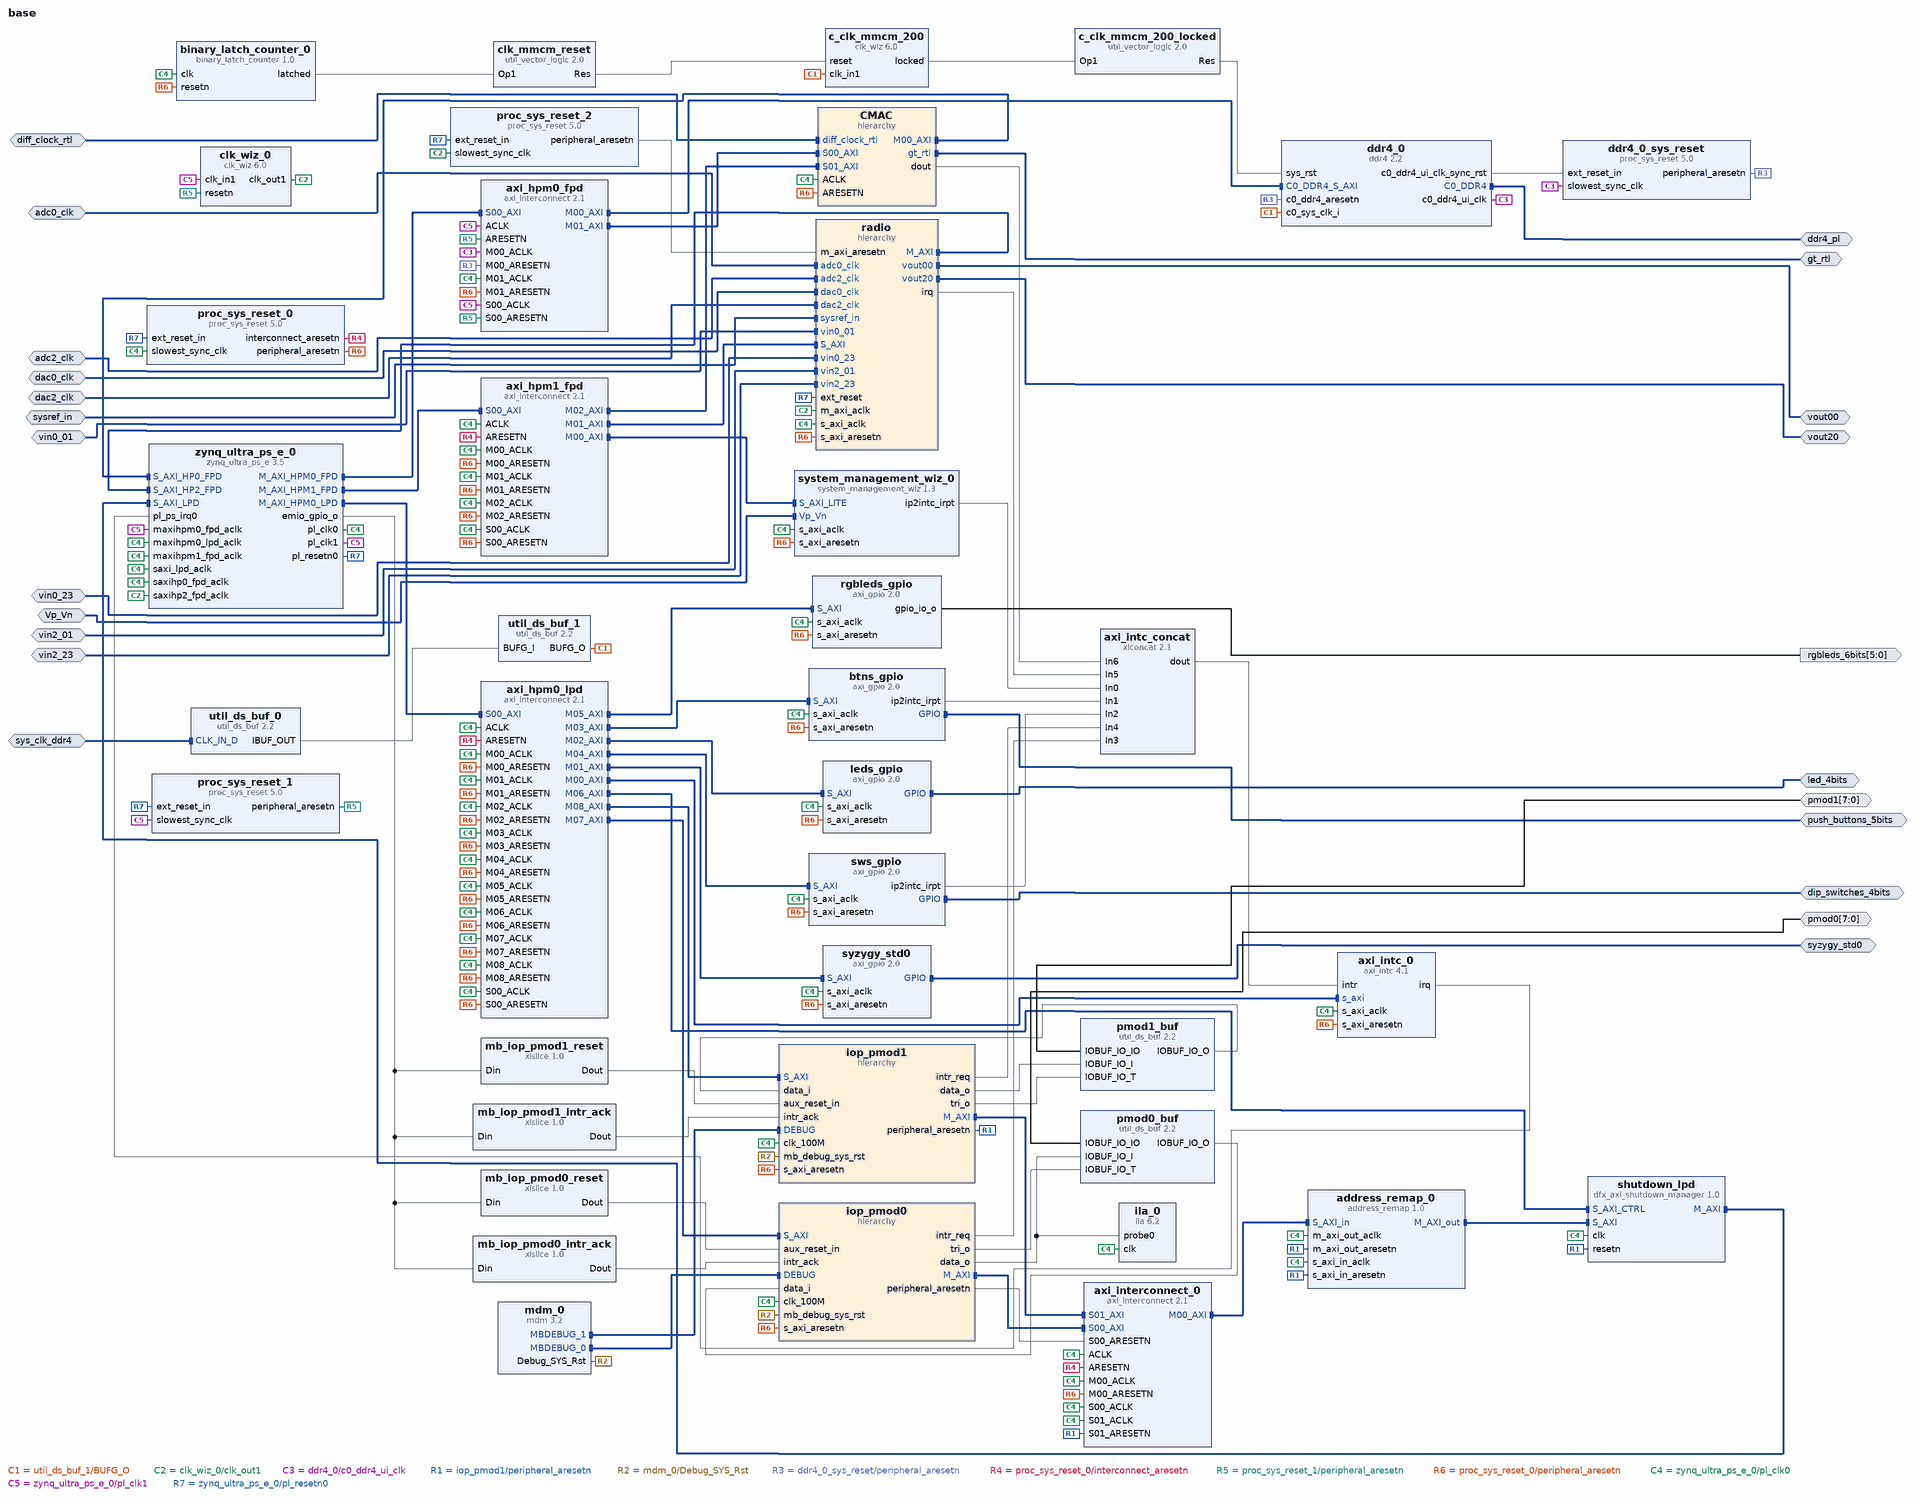
[diagram p0: block diagram of the top level]
# Vivado block design base, xczu48dr-ffvg1517-2-e, Vivado 2024.1
create_bd_design base

create_bd_intf_port -mode Slave -vlnv xilinx.com:interface:diff_analog_io_rtl:1.0 Vp_Vn
create_bd_intf_port -mode Slave -vlnv xilinx.com:interface:diff_clock_rtl:1.0 adc0_clk
set_property -dict {CONFIG.FREQ_HZ 491520000.0} [get_bd_intf_ports adc0_clk]
create_bd_intf_port -mode Slave -vlnv xilinx.com:interface:diff_clock_rtl:1.0 adc2_clk
set_property -dict {CONFIG.FREQ_HZ 491520000.0} [get_bd_intf_ports adc2_clk]
create_bd_intf_port -mode Slave -vlnv xilinx.com:interface:diff_clock_rtl:1.0 dac0_clk
set_property -dict {CONFIG.FREQ_HZ 491520000.0} [get_bd_intf_ports dac0_clk]
create_bd_intf_port -mode Slave -vlnv xilinx.com:interface:diff_clock_rtl:1.0 dac2_clk
set_property -dict {CONFIG.FREQ_HZ 491520000.0} [get_bd_intf_ports dac2_clk]
create_bd_intf_port -mode Master -vlnv xilinx.com:interface:ddr4_rtl:1.0 ddr4_pl
create_bd_intf_port -mode Slave -vlnv xilinx.com:interface:diff_clock_rtl:1.0 diff_clock_rtl
set_property -dict {CONFIG.FREQ_HZ 156250000} [get_bd_intf_ports diff_clock_rtl]
create_bd_intf_port -mode Master -vlnv xilinx.com:interface:gpio_rtl:1.0 dip_switches_4bits
create_bd_intf_port -mode Master -vlnv xilinx.com:interface:gt_rtl:1.0 gt_rtl
create_bd_intf_port -mode Master -vlnv xilinx.com:interface:gpio_rtl:1.0 led_4bits
create_bd_intf_port -mode Master -vlnv xilinx.com:interface:gpio_rtl:1.0 push_buttons_5bits
create_bd_intf_port -mode Slave -vlnv xilinx.com:interface:diff_clock_rtl:1.0 sys_clk_ddr4
set_property -dict {CONFIG.FREQ_HZ 200000000} [get_bd_intf_ports sys_clk_ddr4]
create_bd_intf_port -mode Slave -vlnv xilinx.com:display_usp_rf_data_converter:diff_pins_rtl:1.0 sysref_in
create_bd_intf_port -mode Master -vlnv xilinx.com:interface:gpio_rtl:1.0 syzygy_std0
create_bd_intf_port -mode Slave -vlnv xilinx.com:interface:diff_analog_io_rtl:1.0 vin0_01
create_bd_intf_port -mode Slave -vlnv xilinx.com:interface:diff_analog_io_rtl:1.0 vin0_23
create_bd_intf_port -mode Slave -vlnv xilinx.com:interface:diff_analog_io_rtl:1.0 vin2_01
create_bd_intf_port -mode Slave -vlnv xilinx.com:interface:diff_analog_io_rtl:1.0 vin2_23
create_bd_intf_port -mode Master -vlnv xilinx.com:interface:diff_analog_io_rtl:1.0 vout00
create_bd_intf_port -mode Master -vlnv xilinx.com:interface:diff_analog_io_rtl:1.0 vout20
create_bd_port -dir IO -from 7 -to 0 pmod0
create_bd_port -dir IO -from 7 -to 0 pmod1
create_bd_port -dir O -from 5 -to 0 rgbleds_6bits

create_bd_cell -type hier CMAC
create_bd_cell -type ip -vlnv user.org:user:address_remap:1.0 address_remap_0
set_property -dict [list \
  CONFIG.C_M_AXI_out_ADDR_WIDTH 31 \
  CONFIG.C_M_AXI_out_DATA_WIDTH 128 \
  CONFIG.C_S_AXI_in_ADDR_WIDTH 31 \
  CONFIG.C_S_AXI_in_DATA_WIDTH 128 \
] [get_bd_cells address_remap_0]
create_bd_cell -type ip -vlnv xilinx.com:ip:axi_interconnect:2.1 axi_hpm0_fpd
set_property -dict {CONFIG.NUM_MI 2 CONFIG.S00_HAS_DATA_FIFO 2} [get_bd_cells axi_hpm0_fpd]
create_bd_cell -type ip -vlnv xilinx.com:ip:axi_interconnect:2.1 axi_hpm0_lpd
set_property -dict {CONFIG.NUM_MI 9} [get_bd_cells axi_hpm0_lpd]
create_bd_cell -type ip -vlnv xilinx.com:ip:axi_interconnect:2.1 axi_hpm1_fpd
set_property -dict {CONFIG.NUM_MI 3} [get_bd_cells axi_hpm1_fpd]
create_bd_cell -type ip -vlnv xilinx.com:ip:axi_intc:4.1 axi_intc_0
set_property -dict {CONFIG.C_IRQ_CONNECTION 1} [get_bd_cells axi_intc_0]
create_bd_cell -type ip -vlnv xilinx.com:ip:xlconcat:2.1 axi_intc_concat
set_property -dict {CONFIG.NUM_PORTS 7} [get_bd_cells axi_intc_concat]
create_bd_cell -type ip -vlnv xilinx.com:ip:axi_interconnect:2.1 axi_interconnect_0
set_property -dict {CONFIG.NUM_MI 1 CONFIG.NUM_SI 2} [get_bd_cells axi_interconnect_0]
create_bd_cell -type ip -vlnv xilinx:user:binary_latch_counter:1.0 binary_latch_counter_0
create_bd_cell -type ip -vlnv xilinx.com:ip:axi_gpio:2.0 btns_gpio
set_property -dict [list \
  CONFIG.C_INTERRUPT_PRESENT 1 \
  CONFIG.GPIO_BOARD_INTERFACE push_buttons_5bits \
  CONFIG.USE_BOARD_FLOW true \
] [get_bd_cells btns_gpio]
create_bd_cell -type ip -vlnv xilinx.com:ip:clk_wiz:6.0 c_clk_mmcm_200
set_property -dict [list \
  CONFIG.CLKIN1_JITTER_PS 50.0 \
  CONFIG.CLKOUT1_JITTER 92.799 \
  CONFIG.CLKOUT1_PHASE_ERROR 82.655 \
  CONFIG.CLKOUT1_REQUESTED_OUT_FREQ 200.000 \
  CONFIG.MMCM_CLKFBOUT_MULT_F 6.000 \
  CONFIG.MMCM_CLKIN1_PERIOD 5.000 \
  CONFIG.MMCM_CLKIN2_PERIOD 10.0 \
  CONFIG.MMCM_CLKOUT0_DIVIDE_F 6.000 \
  CONFIG.PRIM_IN_FREQ 200.000 \
  CONFIG.PRIM_SOURCE No_buffer \
] [get_bd_cells c_clk_mmcm_200]
create_bd_cell -type ip -vlnv xilinx.com:ip:util_vector_logic:2.0 c_clk_mmcm_200_locked
set_property -dict {CONFIG.C_OPERATION not CONFIG.C_SIZE 1} [get_bd_cells c_clk_mmcm_200_locked]
create_bd_cell -type ip -vlnv xilinx.com:ip:util_vector_logic:2.0 clk_mmcm_reset
set_property -dict {CONFIG.C_OPERATION not CONFIG.C_SIZE 1} [get_bd_cells clk_mmcm_reset]
create_bd_cell -type ip -vlnv xilinx.com:ip:clk_wiz:6.0 clk_wiz_0
set_property -dict [list \
  CONFIG.CLKIN1_JITTER_PS 33.330000000000005 \
  CONFIG.CLKOUT1_JITTER 177.750 \
  CONFIG.CLKOUT1_PHASE_ERROR 352.538 \
  CONFIG.CLKOUT1_REQUESTED_OUT_FREQ 310.000 \
  CONFIG.MMCM_CLKFBOUT_MULT_F 120.125 \
  CONFIG.MMCM_CLKIN1_PERIOD 3.333 \
  CONFIG.MMCM_CLKIN2_PERIOD 10.0 \
  CONFIG.MMCM_CLKOUT0_DIVIDE_F 3.875 \
  CONFIG.MMCM_DIVCLK_DIVIDE 30 \
  CONFIG.RESET_PORT resetn \
  CONFIG.RESET_TYPE ACTIVE_LOW \
] [get_bd_cells clk_wiz_0]
create_bd_cell -type ip -vlnv xilinx.com:ip:ddr4:2.2 ddr4_0
set_property -dict [list \
  CONFIG.C0.BANK_GROUP_WIDTH 1 \
  CONFIG.C0.DDR4_AxiAddressWidth 33 \
  CONFIG.C0.DDR4_AxiDataWidth 512 \
  CONFIG.C0.DDR4_CasLatency 17 \
  CONFIG.C0.DDR4_CasWriteLatency 12 \
  CONFIG.C0.DDR4_DataWidth 64 \
  CONFIG.C0.DDR4_InputClockPeriod 4998 \
  CONFIG.C0.DDR4_MemoryPart MT40A1G16RC-062E \
  CONFIG.C0.DDR4_MemoryType Components \
  CONFIG.C0.DDR4_TimePeriod 833 \
  CONFIG.System_Clock No_Buffer \
] [get_bd_cells ddr4_0]
create_bd_cell -type ip -vlnv xilinx.com:ip:proc_sys_reset:5.0 ddr4_0_sys_reset
create_bd_cell -type ip -vlnv xilinx.com:ip:ila:6.2 ila_0
set_property -dict [list \
  CONFIG.C_ENABLE_ILA_AXI_MON false \
  CONFIG.C_MONITOR_TYPE Native \
  CONFIG.C_NUM_OF_PROBES 1 \
  CONFIG.C_PROBE0_WIDTH 8 \
] [get_bd_cells ila_0]
create_bd_cell -type hier iop_pmod0
create_bd_cell -type hier iop_pmod1
create_bd_cell -type ip -vlnv xilinx.com:ip:axi_gpio:2.0 leds_gpio
set_property -dict {CONFIG.GPIO_BOARD_INTERFACE led_4bits CONFIG.USE_BOARD_FLOW true} [get_bd_cells leds_gpio]
create_bd_cell -type ip -vlnv xilinx.com:ip:xlslice:1.0 mb_iop_pmod0_intr_ack
set_property -dict {CONFIG.DIN_FROM 1 CONFIG.DIN_TO 1 CONFIG.DIN_WIDTH 4 CONFIG.DOUT_WIDTH 1} [get_bd_cells mb_iop_pmod0_intr_ack]
create_bd_cell -type ip -vlnv xilinx.com:ip:xlslice:1.0 mb_iop_pmod0_reset
set_property -dict {CONFIG.DIN_WIDTH 4} [get_bd_cells mb_iop_pmod0_reset]
create_bd_cell -type ip -vlnv xilinx.com:ip:xlslice:1.0 mb_iop_pmod1_intr_ack
set_property -dict {CONFIG.DIN_FROM 3 CONFIG.DIN_TO 3 CONFIG.DIN_WIDTH 4 CONFIG.DOUT_WIDTH 1} [get_bd_cells mb_iop_pmod1_intr_ack]
create_bd_cell -type ip -vlnv xilinx.com:ip:xlslice:1.0 mb_iop_pmod1_reset
set_property -dict {CONFIG.DIN_FROM 2 CONFIG.DIN_TO 2 CONFIG.DIN_WIDTH 4 CONFIG.DOUT_WIDTH 1} [get_bd_cells mb_iop_pmod1_reset]
create_bd_cell -type ip -vlnv xilinx.com:ip:mdm:3.2 mdm_0
set_property -dict {CONFIG.C_MB_DBG_PORTS 2} [get_bd_cells mdm_0]
create_bd_cell -type ip -vlnv xilinx.com:ip:util_ds_buf:2.2 pmod0_buf
set_property -dict {CONFIG.C_BUF_TYPE IOBUF CONFIG.C_SIZE 8} [get_bd_cells pmod0_buf]
create_bd_cell -type ip -vlnv xilinx.com:ip:util_ds_buf:2.2 pmod1_buf
set_property -dict {CONFIG.C_BUF_TYPE IOBUF CONFIG.C_SIZE 8} [get_bd_cells pmod1_buf]
create_bd_cell -type ip -vlnv xilinx.com:ip:proc_sys_reset:5.0 proc_sys_reset_0
create_bd_cell -type ip -vlnv xilinx.com:ip:proc_sys_reset:5.0 proc_sys_reset_1
create_bd_cell -type ip -vlnv xilinx.com:ip:proc_sys_reset:5.0 proc_sys_reset_2
create_bd_cell -type hier radio
create_bd_cell -type ip -vlnv xilinx.com:ip:axi_gpio:2.0 rgbleds_gpio
set_property -dict [list \
  CONFIG.C_ALL_OUTPUTS 1 \
  CONFIG.C_GPIO_WIDTH 6 \
  CONFIG.GPIO_BOARD_INTERFACE Custom \
  CONFIG.USE_BOARD_FLOW true \
] [get_bd_cells rgbleds_gpio]
create_bd_cell -type ip -vlnv xilinx.com:ip:dfx_axi_shutdown_manager:1.0 shutdown_lpd
set_property -dict {CONFIG.CTRL_INTERFACE_TYPE 1 CONFIG.DP_AXI_DATA_WIDTH 128} [get_bd_cells shutdown_lpd]
create_bd_cell -type ip -vlnv xilinx.com:ip:axi_gpio:2.0 sws_gpio
set_property -dict [list \
  CONFIG.C_INTERRUPT_PRESENT 1 \
  CONFIG.GPIO_BOARD_INTERFACE dip_switches_4bits \
  CONFIG.USE_BOARD_FLOW true \
] [get_bd_cells sws_gpio]
create_bd_cell -type ip -vlnv xilinx.com:ip:system_management_wiz:1.3 system_management_wiz_0
set_property -dict {CONFIG.INTERFACE_SELECTION Enable_AXI} [get_bd_cells system_management_wiz_0]
create_bd_cell -type ip -vlnv xilinx.com:ip:axi_gpio:2.0 syzygy_std0
create_bd_cell -type ip -vlnv xilinx.com:ip:util_ds_buf:2.2 util_ds_buf_0
set_property -dict {CONFIG.C_BUF_TYPE IBUFDS} [get_bd_cells util_ds_buf_0]
create_bd_cell -type ip -vlnv xilinx.com:ip:util_ds_buf:2.2 util_ds_buf_1
set_property -dict {CONFIG.C_BUF_TYPE BUFG} [get_bd_cells util_ds_buf_1]
create_bd_cell -type ip -vlnv xilinx.com:ip:zynq_ultra_ps_e:3.5 zynq_ultra_ps_e_0
set_property -dict [list \
  CONFIG.CAN0_BOARD_INTERFACE custom \
  CONFIG.CAN1_BOARD_INTERFACE custom \
  CONFIG.CSU_BOARD_INTERFACE custom \
  CONFIG.DP_BOARD_INTERFACE custom \
  CONFIG.GEM0_BOARD_INTERFACE custom \
  CONFIG.GEM1_BOARD_INTERFACE custom \
  CONFIG.GEM2_BOARD_INTERFACE custom \
  CONFIG.GEM3_BOARD_INTERFACE custom \
  CONFIG.GPIO_BOARD_INTERFACE custom \
  CONFIG.IIC0_BOARD_INTERFACE custom \
  CONFIG.IIC1_BOARD_INTERFACE custom \
  CONFIG.NAND_BOARD_INTERFACE custom \
  CONFIG.PCIE_BOARD_INTERFACE custom \
  CONFIG.PJTAG_BOARD_INTERFACE custom \
  CONFIG.PMU_BOARD_INTERFACE custom \
  CONFIG.PSU_BANK_0_IO_STANDARD LVCMOS33 \
  CONFIG.PSU_BANK_1_IO_STANDARD LVCMOS18 \
  CONFIG.PSU_BANK_2_IO_STANDARD LVCMOS18 \
  CONFIG.PSU_BANK_3_IO_STANDARD LVCMOS18 \
  CONFIG.PSU_USB3__DUAL_CLOCK_ENABLE 1 \
  CONFIG.PSU__CAN1__PERIPHERAL__ENABLE 0 \
  CONFIG.PSU__CRF_APB__ACPU_CTRL__FREQMHZ 1200 \
  CONFIG.PSU__CRF_APB__ACPU_CTRL__SRCSEL APLL \
  CONFIG.PSU__CRF_APB__APLL_CTRL__SRCSEL PSS_REF_CLK \
  CONFIG.PSU__CRF_APB__DBG_FPD_CTRL__FREQMHZ 250 \
  CONFIG.PSU__CRF_APB__DBG_FPD_CTRL__SRCSEL IOPLL \
  CONFIG.PSU__CRF_APB__DBG_TRACE_CTRL__FREQMHZ 250 \
  CONFIG.PSU__CRF_APB__DBG_TRACE_CTRL__SRCSEL IOPLL \
  CONFIG.PSU__CRF_APB__DBG_TSTMP_CTRL__FREQMHZ 250 \
  CONFIG.PSU__CRF_APB__DBG_TSTMP_CTRL__SRCSEL IOPLL \
  CONFIG.PSU__CRF_APB__DDR_CTRL__FREQMHZ 1200 \
  CONFIG.PSU__CRF_APB__DDR_CTRL__SRCSEL DPLL \
  CONFIG.PSU__CRF_APB__DPDMA_REF_CTRL__FREQMHZ 600 \
  CONFIG.PSU__CRF_APB__DPDMA_REF_CTRL__SRCSEL DPLL \
  CONFIG.PSU__CRF_APB__DPLL_CTRL__SRCSEL PSS_REF_CLK \
  CONFIG.PSU__CRF_APB__DP_AUDIO_REF_CTRL__SRCSEL RPLL \
  CONFIG.PSU__CRF_APB__DP_STC_REF_CTRL__SRCSEL RPLL \
  CONFIG.PSU__CRF_APB__DP_VIDEO_REF_CTRL__SRCSEL DPLL \
  CONFIG.PSU__CRF_APB__GDMA_REF_CTRL__FREQMHZ 600 \
  CONFIG.PSU__CRF_APB__GDMA_REF_CTRL__SRCSEL DPLL \
  CONFIG.PSU__CRF_APB__GPU_REF_CTRL__FREQMHZ 600 \
  CONFIG.PSU__CRF_APB__GPU_REF_CTRL__SRCSEL DPLL \
  CONFIG.PSU__CRF_APB__TOPSW_LSBUS_CTRL__FREQMHZ 100 \
  CONFIG.PSU__CRF_APB__TOPSW_LSBUS_CTRL__SRCSEL IOPLL \
  CONFIG.PSU__CRF_APB__TOPSW_MAIN_CTRL__FREQMHZ 533.33 \
  CONFIG.PSU__CRF_APB__TOPSW_MAIN_CTRL__SRCSEL DPLL \
  CONFIG.PSU__CRF_APB__VPLL_CTRL__SRCSEL PSS_REF_CLK \
  CONFIG.PSU__CRL_APB__ADMA_REF_CTRL__FREQMHZ 533.333 \
  CONFIG.PSU__CRL_APB__ADMA_REF_CTRL__SRCSEL RPLL \
  CONFIG.PSU__CRL_APB__CAN1_REF_CTRL__FREQMHZ 100 \
  CONFIG.PSU__CRL_APB__CAN1_REF_CTRL__SRCSEL IOPLL \
  CONFIG.PSU__CRL_APB__CPU_R5_CTRL__FREQMHZ 500 \
  CONFIG.PSU__CRL_APB__CPU_R5_CTRL__SRCSEL IOPLL \
  CONFIG.PSU__CRL_APB__DBG_LPD_CTRL__FREQMHZ 250 \
  CONFIG.PSU__CRL_APB__DBG_LPD_CTRL__SRCSEL IOPLL \
  CONFIG.PSU__CRL_APB__GEM3_REF_CTRL__FREQMHZ 125 \
  CONFIG.PSU__CRL_APB__GEM3_REF_CTRL__SRCSEL IOPLL \
  CONFIG.PSU__CRL_APB__I2C0_REF_CTRL__FREQMHZ 100 \
  CONFIG.PSU__CRL_APB__I2C0_REF_CTRL__SRCSEL IOPLL \
  CONFIG.PSU__CRL_APB__I2C1_REF_CTRL__FREQMHZ 100 \
  CONFIG.PSU__CRL_APB__I2C1_REF_CTRL__SRCSEL IOPLL \
  CONFIG.PSU__CRL_APB__IOPLL_CTRL__SRCSEL PSS_REF_CLK \
  CONFIG.PSU__CRL_APB__IOU_SWITCH_CTRL__FREQMHZ 267 \
  CONFIG.PSU__CRL_APB__IOU_SWITCH_CTRL__SRCSEL RPLL \
  CONFIG.PSU__CRL_APB__LPD_LSBUS_CTRL__FREQMHZ 100 \
  CONFIG.PSU__CRL_APB__LPD_LSBUS_CTRL__SRCSEL IOPLL \
  CONFIG.PSU__CRL_APB__LPD_SWITCH_CTRL__FREQMHZ 533.333 \
  CONFIG.PSU__CRL_APB__LPD_SWITCH_CTRL__SRCSEL RPLL \
  CONFIG.PSU__CRL_APB__PCAP_CTRL__FREQMHZ 200 \
  CONFIG.PSU__CRL_APB__PCAP_CTRL__SRCSEL IOPLL \
  CONFIG.PSU__CRL_APB__PL0_REF_CTRL__FREQMHZ 100 \
  CONFIG.PSU__CRL_APB__PL0_REF_CTRL__SRCSEL IOPLL \
  CONFIG.PSU__CRL_APB__PL1_REF_CTRL__FREQMHZ 300 \
  CONFIG.PSU__CRL_APB__PL1_REF_CTRL__SRCSEL IOPLL \
  CONFIG.PSU__CRL_APB__QSPI_REF_CTRL__FREQMHZ 125 \
  CONFIG.PSU__CRL_APB__QSPI_REF_CTRL__SRCSEL IOPLL \
  CONFIG.PSU__CRL_APB__RPLL_CTRL__SRCSEL PSS_REF_CLK \
  CONFIG.PSU__CRL_APB__SDIO0_REF_CTRL__SRCSEL IOPLL \
  CONFIG.PSU__CRL_APB__SDIO1_REF_CTRL__FREQMHZ 200 \
  CONFIG.PSU__CRL_APB__SDIO1_REF_CTRL__SRCSEL IOPLL \
  CONFIG.PSU__CRL_APB__SPI0_REF_CTRL__FREQMHZ 20 \
  CONFIG.PSU__CRL_APB__SPI0_REF_CTRL__SRCSEL IOPLL \
  CONFIG.PSU__CRL_APB__SPI1_REF_CTRL__FREQMHZ 1 \
  CONFIG.PSU__CRL_APB__SPI1_REF_CTRL__SRCSEL IOPLL \
  CONFIG.PSU__CRL_APB__TIMESTAMP_REF_CTRL__FREQMHZ 100 \
  CONFIG.PSU__CRL_APB__TIMESTAMP_REF_CTRL__SRCSEL PSS_REF_CLK \
  CONFIG.PSU__CRL_APB__UART0_REF_CTRL__FREQMHZ 100 \
  CONFIG.PSU__CRL_APB__UART0_REF_CTRL__SRCSEL IOPLL \
  CONFIG.PSU__CRL_APB__UART1_REF_CTRL__FREQMHZ 100 \
  CONFIG.PSU__CRL_APB__UART1_REF_CTRL__SRCSEL IOPLL \
  CONFIG.PSU__CRL_APB__USB0_BUS_REF_CTRL__FREQMHZ 250 \
  CONFIG.PSU__CRL_APB__USB0_BUS_REF_CTRL__SRCSEL IOPLL \
  CONFIG.PSU__CRL_APB__USB3_DUAL_REF_CTRL__FREQMHZ 20 \
  CONFIG.PSU__CRL_APB__USB3_DUAL_REF_CTRL__SRCSEL IOPLL \
  CONFIG.PSU__CRL_APB__USB3__ENABLE 1 \
  CONFIG.PSU__CSUPMU__PERIPHERAL__VALID 0 \
  CONFIG.PSU__DDRC__BUS_WIDTH {64 Bit} \
  CONFIG.PSU__DDRC__COMPONENTS Components \
  CONFIG.PSU__DDRC__DEVICE_CAPACITY {16384 MBits} \
  CONFIG.PSU__DDRC__DRAM_WIDTH {16 Bits} \
  CONFIG.PSU__DDRC__ECC Disabled \
  CONFIG.PSU__DDRC__MEMORY_TYPE {DDR 4} \
  CONFIG.PSU__DDRC__SPEED_BIN DDR4_2400R \
  CONFIG.PSU__DDR_HIGH_ADDRESS_GUI_ENABLE 1 \
  CONFIG.PSU__DDR__INTERFACE__FREQMHZ 600.000 \
  CONFIG.PSU__DEVICE_TYPE RFSOC \
  CONFIG.PSU__DISPLAYPORT__LANE0__ENABLE 1 \
  CONFIG.PSU__DISPLAYPORT__LANE0__IO {GT Lane1} \
  CONFIG.PSU__DISPLAYPORT__LANE1__ENABLE 1 \
  CONFIG.PSU__DISPLAYPORT__LANE1__IO {GT Lane0} \
  CONFIG.PSU__DISPLAYPORT__PERIPHERAL__ENABLE 1 \
  CONFIG.PSU__DLL__ISUSED 1 \
  CONFIG.PSU__DPAUX__PERIPHERAL__ENABLE 1 \
  CONFIG.PSU__DPAUX__PERIPHERAL__IO {MIO 27 .. 30} \
  CONFIG.PSU__DP__LANE_SEL {Dual Lower} \
  CONFIG.PSU__DP__REF_CLK_FREQ 27 \
  CONFIG.PSU__DP__REF_CLK_SEL {Ref Clk0} \
  CONFIG.PSU__ENET1__GRP_MDIO__ENABLE 1 \
  CONFIG.PSU__ENET1__GRP_MDIO__IO {MIO 50 .. 51} \
  CONFIG.PSU__ENET1__PERIPHERAL__ENABLE 1 \
  CONFIG.PSU__ENET1__PERIPHERAL__IO {MIO 38 .. 49} \
  CONFIG.PSU__ENET3__PERIPHERAL__ENABLE 0 \
  CONFIG.PSU__FPD_SLCR__WDT1__FREQMHZ 100 \
  CONFIG.PSU__FPGA_PL0_ENABLE 1 \
  CONFIG.PSU__FPGA_PL1_ENABLE 1 \
  CONFIG.PSU__GEM__TSU__ENABLE 0 \
  CONFIG.PSU__GPIO0_MIO__IO {MIO 0 .. 25} \
  CONFIG.PSU__GPIO0_MIO__PERIPHERAL__ENABLE 1 \
  CONFIG.PSU__GPIO1_MIO__IO {MIO 26 .. 51} \
  CONFIG.PSU__GPIO1_MIO__PERIPHERAL__ENABLE 1 \
  CONFIG.PSU__GPIO2_MIO__IO {MIO 52 .. 77} \
  CONFIG.PSU__GPIO2_MIO__PERIPHERAL__ENABLE 1 \
  CONFIG.PSU__GPIO_EMIO_WIDTH 95 \
  CONFIG.PSU__GPIO_EMIO__PERIPHERAL__ENABLE 1 \
  CONFIG.PSU__GPIO_EMIO__PERIPHERAL__IO 95 \
  CONFIG.PSU__GPU_PP0__POWER__ON 0 \
  CONFIG.PSU__GPU_PP1__POWER__ON 0 \
  CONFIG.PSU__GT__LINK_SPEED HBR \
  CONFIG.PSU__GT__PRE_EMPH_LVL_4 0 \
  CONFIG.PSU__GT__VLT_SWNG_LVL_4 0 \
  CONFIG.PSU__I2C0__PERIPHERAL__ENABLE 1 \
  CONFIG.PSU__I2C0__PERIPHERAL__IO {MIO 18 .. 19} \
  CONFIG.PSU__I2C1__PERIPHERAL__ENABLE 1 \
  CONFIG.PSU__I2C1__PERIPHERAL__IO {MIO 36 .. 37} \
  CONFIG.PSU__IOU_SLCR__IOU_TTC_APB_CLK__TTC0_SEL APB \
  CONFIG.PSU__IOU_SLCR__IOU_TTC_APB_CLK__TTC1_SEL APB \
  CONFIG.PSU__IOU_SLCR__IOU_TTC_APB_CLK__TTC2_SEL APB \
  CONFIG.PSU__IOU_SLCR__IOU_TTC_APB_CLK__TTC3_SEL APB \
  CONFIG.PSU__IOU_SLCR__TTC0__FREQMHZ 100 \
  CONFIG.PSU__IOU_SLCR__TTC1__FREQMHZ 100 \
  CONFIG.PSU__IOU_SLCR__TTC2__FREQMHZ 100 \
  CONFIG.PSU__IOU_SLCR__TTC3__FREQMHZ 100 \
  CONFIG.PSU__IOU_SLCR__WDT0__FREQMHZ 100 \
  CONFIG.PSU__LPD_SLCR__CSUPMU__FREQMHZ 100 \
  CONFIG.PSU__MAXIGP0__DATA_WIDTH 128 \
  CONFIG.PSU__OVERRIDE_HPX_QOS 0 \
  CONFIG.PSU__OVERRIDE__BASIC_CLOCK 0 \
  CONFIG.PSU__PMU__PERIPHERAL__ENABLE 0 \
  CONFIG.PSU__PRESET_APPLIED 1 \
  CONFIG.PSU__PSS_REF_CLK__FREQMHZ 33.33333 \
  CONFIG.PSU__QSPI__PERIPHERAL__ENABLE 0 \
  CONFIG.PSU__SATA__PERIPHERAL__ENABLE 0 \
  CONFIG.PSU__SD0__CLK_50_SDR_ITAP_DLY 0x15 \
  CONFIG.PSU__SD0__CLK_50_SDR_OTAP_DLY 0x5 \
  CONFIG.PSU__SD0__DATA_TRANSFER_MODE 4Bit \
  CONFIG.PSU__SD0__GRP_CD__ENABLE 1 \
  CONFIG.PSU__SD0__GRP_CD__IO {MIO 24} \
  CONFIG.PSU__SD0__GRP_WP__ENABLE 1 \
  CONFIG.PSU__SD0__GRP_WP__IO {MIO 25} \
  CONFIG.PSU__SD0__PERIPHERAL__ENABLE 1 \
  CONFIG.PSU__SD0__PERIPHERAL__IO {MIO 13 .. 16 21 22} \
  CONFIG.PSU__SD0__SLOT_TYPE {SD 2.0} \
  CONFIG.PSU__SD1__CLK_100_SDR_OTAP_DLY 0x3 \
  CONFIG.PSU__SD1__CLK_200_SDR_OTAP_DLY 0x3 \
  CONFIG.PSU__SD1__CLK_50_DDR_ITAP_DLY 0x3D \
  CONFIG.PSU__SD1__CLK_50_DDR_OTAP_DLY 0x4 \
  CONFIG.PSU__SD1__CLK_50_SDR_ITAP_DLY 0x15 \
  CONFIG.PSU__SD1__CLK_50_SDR_OTAP_DLY 0x5 \
  CONFIG.PSU__SD1__PERIPHERAL__ENABLE 0 \
  CONFIG.PSU__SPI0__GRP_SS0__IO {MIO 3} \
  CONFIG.PSU__SPI0__GRP_SS1__ENABLE 1 \
  CONFIG.PSU__SPI0__GRP_SS1__IO {MIO 2} \
  CONFIG.PSU__SPI0__GRP_SS2__ENABLE 1 \
  CONFIG.PSU__SPI0__GRP_SS2__IO {MIO 1} \
  CONFIG.PSU__SPI0__PERIPHERAL__ENABLE 1 \
  CONFIG.PSU__SPI0__PERIPHERAL__IO {MIO 0 .. 5} \
  CONFIG.PSU__SPI1__GRP_SS0__IO {MIO 9} \
  CONFIG.PSU__SPI1__PERIPHERAL__ENABLE 1 \
  CONFIG.PSU__SPI1__PERIPHERAL__IO {MIO 6 .. 11} \
  CONFIG.PSU__SWDT0__PERIPHERAL__ENABLE 0 \
  CONFIG.PSU__SWDT1__PERIPHERAL__ENABLE 0 \
  CONFIG.PSU__TSU__BUFG_PORT_PAIR 0 \
  CONFIG.PSU__TTC0__PERIPHERAL__ENABLE 0 \
  CONFIG.PSU__TTC1__PERIPHERAL__ENABLE 0 \
  CONFIG.PSU__TTC2__PERIPHERAL__ENABLE 0 \
  CONFIG.PSU__TTC3__PERIPHERAL__ENABLE 0 \
  CONFIG.PSU__UART0__PERIPHERAL__ENABLE 0 \
  CONFIG.PSU__UART1__BAUD_RATE 115200 \
  CONFIG.PSU__UART1__MODEM__ENABLE 0 \
  CONFIG.PSU__UART1__PERIPHERAL__ENABLE 1 \
  CONFIG.PSU__UART1__PERIPHERAL__IO {MIO 32 .. 33} \
  CONFIG.PSU__USB0_COHERENCY 0 \
  CONFIG.PSU__USB0__PERIPHERAL__ENABLE 1 \
  CONFIG.PSU__USB0__PERIPHERAL__IO {MIO 52 .. 63} \
  CONFIG.PSU__USB0__REF_CLK_FREQ 100 \
  CONFIG.PSU__USB0__REF_CLK_SEL {Ref Clk1} \
  CONFIG.PSU__USB1__PERIPHERAL__ENABLE 1 \
  CONFIG.PSU__USB1__PERIPHERAL__IO {MIO 64 .. 75} \
  CONFIG.PSU__USB1__REF_CLK_FREQ 100 \
  CONFIG.PSU__USB1__REF_CLK_SEL {Ref Clk1} \
  CONFIG.PSU__USB2_0__EMIO__ENABLE 0 \
  CONFIG.PSU__USB3_0__EMIO__ENABLE 0 \
  CONFIG.PSU__USB3_0__PERIPHERAL__ENABLE 1 \
  CONFIG.PSU__USB3_0__PERIPHERAL__IO {GT Lane2} \
  CONFIG.PSU__USB3_1__PERIPHERAL__ENABLE 1 \
  CONFIG.PSU__USB3_1__PERIPHERAL__IO {GT Lane3} \
  CONFIG.PSU__USB__RESET__MODE {Boot Pin} \
  CONFIG.PSU__USB__RESET__POLARITY {Active Low} \
  CONFIG.PSU__USE__IRQ0 1 \
  CONFIG.PSU__USE__M_AXI_GP0 1 \
  CONFIG.PSU__USE__M_AXI_GP1 1 \
  CONFIG.PSU__USE__M_AXI_GP2 1 \
  CONFIG.PSU__USE__S_AXI_GP2 1 \
  CONFIG.PSU__USE__S_AXI_GP4 1 \
  CONFIG.PSU__USE__S_AXI_GP6 1 \
  CONFIG.QSPI_BOARD_INTERFACE custom \
  CONFIG.SATA_BOARD_INTERFACE custom \
  CONFIG.SD0_BOARD_INTERFACE custom \
  CONFIG.SD1_BOARD_INTERFACE custom \
  CONFIG.SPI0_BOARD_INTERFACE custom \
  CONFIG.SPI1_BOARD_INTERFACE custom \
  CONFIG.SUBPRESET1 Custom \
  CONFIG.SUBPRESET2 Custom \
  CONFIG.SWDT0_BOARD_INTERFACE custom \
  CONFIG.SWDT1_BOARD_INTERFACE custom \
  CONFIG.TRACE_BOARD_INTERFACE custom \
  CONFIG.TTC0_BOARD_INTERFACE custom \
  CONFIG.TTC1_BOARD_INTERFACE custom \
  CONFIG.TTC2_BOARD_INTERFACE custom \
  CONFIG.TTC3_BOARD_INTERFACE custom \
  CONFIG.UART0_BOARD_INTERFACE custom \
  CONFIG.UART1_BOARD_INTERFACE custom \
  CONFIG.USB0_BOARD_INTERFACE custom \
  CONFIG.USB1_BOARD_INTERFACE custom \
] [get_bd_cells zynq_ultra_ps_e_0]
# 722 more settings of zynq_ultra_ps_e_0 are not shown: defaults, MIO pin electricals, DDR timing, and values the tool derives

# ---- hierarchy /CMAC ----
current_bd_instance /CMAC
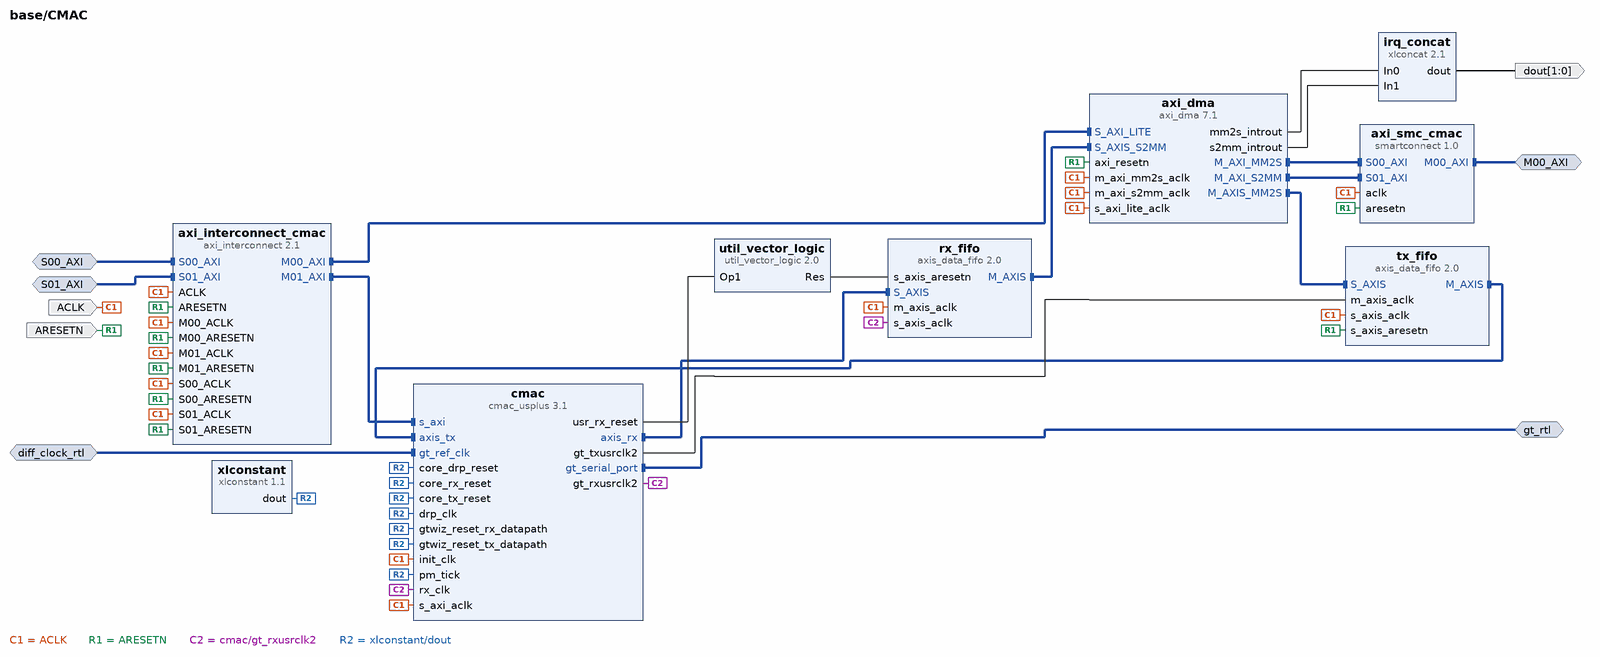
[diagram p1: block diagram inside /CMAC]
create_bd_intf_pin -mode Master -vlnv xilinx.com:interface:aximm_rtl:1.0 M00_AXI
create_bd_intf_pin -mode Slave -vlnv xilinx.com:interface:aximm_rtl:1.0 S00_AXI
create_bd_intf_pin -mode Slave -vlnv xilinx.com:interface:aximm_rtl:1.0 S01_AXI
create_bd_intf_pin -mode Slave -vlnv xilinx.com:interface:diff_clock_rtl:1.0 diff_clock_rtl
create_bd_intf_pin -mode Master -vlnv xilinx.com:interface:gt_rtl:1.0 gt_rtl
create_bd_pin -dir I -type clk ACLK
create_bd_pin -dir I -type rst ARESETN
create_bd_pin -dir O -from 1 -to 0 dout

create_bd_cell -type ip -vlnv xilinx.com:ip:axi_dma:7.1 axi_dma
set_property -dict [list \
  CONFIG.c_include_sg 0 \
  CONFIG.c_m_axi_mm2s_data_width 512 \
  CONFIG.c_m_axi_s2mm_data_width 512 \
  CONFIG.c_m_axis_mm2s_tdata_width 512 \
  CONFIG.c_mm2s_burst_size 16 \
  CONFIG.c_s_axis_s2mm_tdata_width 512 \
  CONFIG.c_sg_length_width 26 \
] [get_bd_cells axi_dma]
create_bd_cell -type ip -vlnv xilinx.com:ip:axi_interconnect:2.1 axi_interconnect_cmac
set_property -dict {CONFIG.NUM_MI 2 CONFIG.NUM_SI 2} [get_bd_cells axi_interconnect_cmac]
create_bd_cell -type ip -vlnv xilinx.com:ip:smartconnect:1.0 axi_smc_cmac
create_bd_cell -type ip -vlnv xilinx.com:ip:cmac_usplus:3.1 cmac
set_property -dict [list \
  CONFIG.CMAC_CAUI4_MODE 1 \
  CONFIG.CMAC_CORE_SELECT CMACE4_X0Y0 \
  CONFIG.ENABLE_AXI_INTERFACE 1 \
  CONFIG.GT_GROUP_SELECT {X0Y4~X0Y7} \
  CONFIG.GT_REF_CLK_FREQ 156.25 \
  CONFIG.INCLUDE_RS_FEC 0 \
  CONFIG.INCLUDE_STATISTICS_COUNTERS 1 \
  CONFIG.INS_LOSS_NYQ 1 \
  CONFIG.NUM_LANES 4x25 \
  CONFIG.RX_EQ_MODE DFE \
  CONFIG.RX_FLOW_CONTROL 0 \
  CONFIG.TX_FLOW_CONTROL 0 \
  CONFIG.USER_INTERFACE AXIS \
] [get_bd_cells cmac]
create_bd_cell -type ip -vlnv xilinx.com:ip:xlconcat:2.1 irq_concat
create_bd_cell -type ip -vlnv xilinx.com:ip:axis_data_fifo:2.0 rx_fifo
set_property -dict {CONFIG.FIFO_MODE 2 CONFIG.HAS_TKEEP 1 CONFIG.IS_ACLK_ASYNC 1 CONFIG.TDATA_NUM_BYTES 64} [get_bd_cells rx_fifo]
create_bd_cell -type ip -vlnv xilinx.com:ip:axis_data_fifo:2.0 tx_fifo
set_property -dict {CONFIG.FIFO_MODE 2 CONFIG.HAS_TKEEP 1 CONFIG.IS_ACLK_ASYNC 1 CONFIG.TDATA_NUM_BYTES 64} [get_bd_cells tx_fifo]
create_bd_cell -type ip -vlnv xilinx.com:ip:util_vector_logic:2.0 util_vector_logic
set_property -dict {CONFIG.C_OPERATION not CONFIG.C_SIZE 1} [get_bd_cells util_vector_logic]
create_bd_cell -type ip -vlnv xilinx.com:ip:xlconstant:1.1 xlconstant
set_property -dict {CONFIG.CONST_VAL 0} [get_bd_cells xlconstant]

# ---- hierarchy /iop_pmod0 ----
current_bd_instance /iop_pmod0
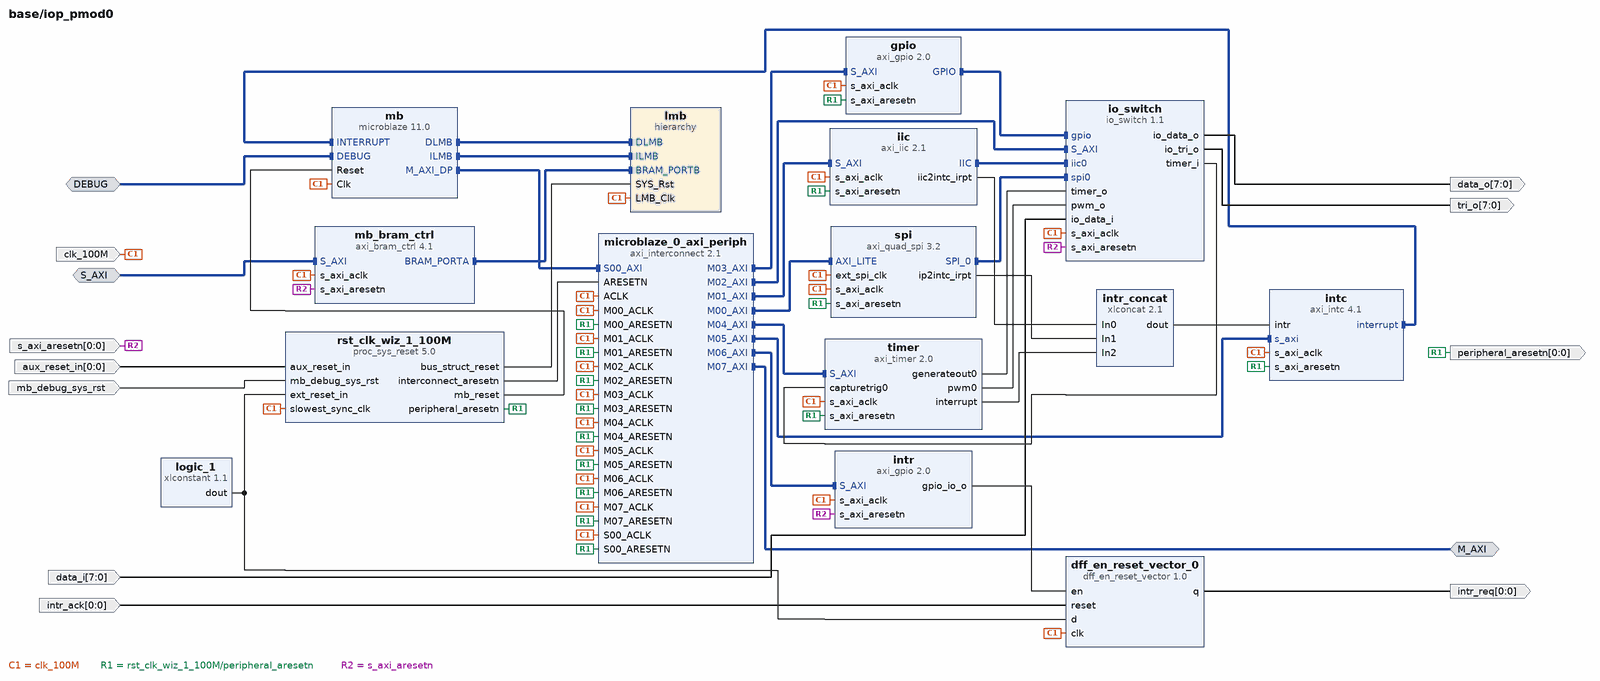
[diagram p2: block diagram inside /iop_pmod0]
create_bd_intf_pin -mode Slave -vlnv xilinx.com:interface:mbdebug_rtl:3.0 DEBUG
create_bd_intf_pin -mode Master -vlnv xilinx.com:interface:aximm_rtl:1.0 M_AXI
create_bd_intf_pin -mode Slave -vlnv xilinx.com:interface:aximm_rtl:1.0 S_AXI
create_bd_pin -dir I -from 0 -to 0 -type rst aux_reset_in
create_bd_pin -dir I -type clk clk_100M
create_bd_pin -dir I -from 7 -to 0 data_i
create_bd_pin -dir O -from 7 -to 0 data_o
create_bd_pin -dir I -from 0 -to 0 intr_ack
create_bd_pin -dir O -from 0 -to 0 intr_req
create_bd_pin -dir I -type rst mb_debug_sys_rst
create_bd_pin -dir O -from 0 -to 0 -type rst peripheral_aresetn
create_bd_pin -dir I -from 0 -to 0 -type rst s_axi_aresetn
create_bd_pin -dir O -from 7 -to 0 tri_o

create_bd_cell -type ip -vlnv xilinx.com:user:dff_en_reset_vector:1.0 dff_en_reset_vector_0
set_property -dict {CONFIG.SIZE 1} [get_bd_cells dff_en_reset_vector_0]
create_bd_cell -type ip -vlnv xilinx.com:ip:axi_gpio:2.0 gpio
set_property -dict {CONFIG.C_GPIO_WIDTH 8 CONFIG.C_IS_DUAL 0} [get_bd_cells gpio]
create_bd_cell -type ip -vlnv xilinx.com:ip:axi_iic:2.1 iic
create_bd_cell -type ip -vlnv xilinx.com:ip:axi_intc:4.1 intc
create_bd_cell -type ip -vlnv xilinx.com:ip:axi_gpio:2.0 intr
set_property -dict {CONFIG.C_ALL_OUTPUTS 1 CONFIG.C_GPIO_WIDTH 1} [get_bd_cells intr]
create_bd_cell -type ip -vlnv xilinx.com:ip:xlconcat:2.1 intr_concat
set_property -dict {CONFIG.NUM_PORTS 3} [get_bd_cells intr_concat]
create_bd_cell -type ip -vlnv xilinx.com:user:io_switch:1.1 io_switch
set_property -dict [list \
  CONFIG.C_INTERFACE_TYPE 1 \
  CONFIG.C_IO_SWITCH_WIDTH 8 \
  CONFIG.C_NUM_PWMS 1 \
  CONFIG.C_NUM_TIMERS 1 \
  CONFIG.I2C0_Enable true \
  CONFIG.PWM_Enable true \
  CONFIG.SPI0_Enable true \
  CONFIG.Timer_Enable true \
] [get_bd_cells io_switch]
create_bd_cell -type hier lmb
create_bd_cell -type ip -vlnv xilinx.com:ip:xlconstant:1.1 logic_1
create_bd_cell -type ip -vlnv xilinx.com:ip:microblaze:11.0 mb
set_property -dict [list \
  CONFIG.C_ADDR_TAG_BITS 17 \
  CONFIG.C_DCACHE_ADDR_TAG 17 \
  CONFIG.C_DEBUG_ENABLED 1 \
  CONFIG.C_D_AXI 1 \
  CONFIG.C_D_LMB 1 \
  CONFIG.C_I_LMB 1 \
] [get_bd_cells mb]
create_bd_cell -type ip -vlnv xilinx.com:ip:axi_bram_ctrl:4.1 mb_bram_ctrl
set_property -dict {CONFIG.SINGLE_PORT_BRAM 1} [get_bd_cells mb_bram_ctrl]
create_bd_cell -type ip -vlnv xilinx.com:ip:axi_interconnect:2.1 microblaze_0_axi_periph
set_property -dict [list \
  CONFIG.M00_HAS_REGSLICE 1 \
  CONFIG.M01_HAS_REGSLICE 1 \
  CONFIG.M02_HAS_REGSLICE 1 \
  CONFIG.M03_HAS_REGSLICE 1 \
  CONFIG.M04_HAS_REGSLICE 1 \
  CONFIG.M05_HAS_REGSLICE 1 \
  CONFIG.M06_HAS_REGSLICE 1 \
  CONFIG.M07_HAS_REGSLICE 1 \
  CONFIG.NUM_MI 8 \
  CONFIG.S00_HAS_REGSLICE 1 \
] [get_bd_cells microblaze_0_axi_periph]
create_bd_cell -type ip -vlnv xilinx.com:ip:proc_sys_reset:5.0 rst_clk_wiz_1_100M
set_property -dict {CONFIG.C_AUX_RESET_HIGH 1} [get_bd_cells rst_clk_wiz_1_100M]
create_bd_cell -type ip -vlnv xilinx.com:ip:axi_quad_spi:3.2 spi
set_property -dict {CONFIG.C_USE_STARTUP 0} [get_bd_cells spi]
create_bd_cell -type ip -vlnv xilinx.com:ip:axi_timer:2.0 timer

# ---- hierarchy /iop_pmod0/lmb ----
current_bd_instance /iop_pmod0/lmb
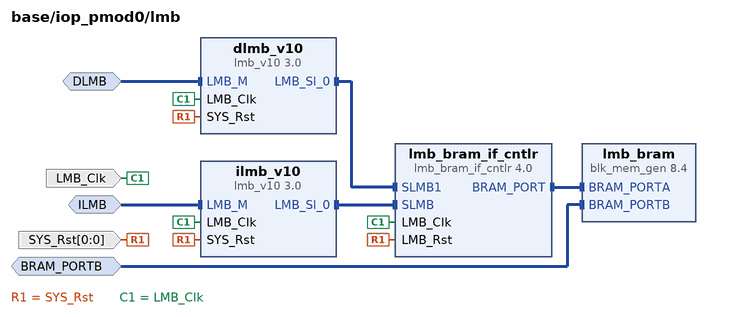
[diagram p3: block diagram inside /iop_pmod0/lmb]
create_bd_intf_pin -mode Slave -vlnv xilinx.com:interface:bram_rtl:1.0 BRAM_PORTB
create_bd_intf_pin -mode MirroredMaster -vlnv xilinx.com:interface:lmb_rtl:1.0 DLMB
create_bd_intf_pin -mode MirroredMaster -vlnv xilinx.com:interface:lmb_rtl:1.0 ILMB
create_bd_pin -dir I -type clk LMB_Clk
create_bd_pin -dir I -from 0 -to 0 -type rst SYS_Rst

create_bd_cell -type ip -vlnv xilinx.com:ip:lmb_v10:3.0 dlmb_v10
create_bd_cell -type ip -vlnv xilinx.com:ip:lmb_v10:3.0 ilmb_v10
create_bd_cell -type ip -vlnv xilinx.com:ip:blk_mem_gen:8.4 lmb_bram
set_property -dict [list \
  CONFIG.Enable_B Use_ENB_Pin \
  CONFIG.Memory_Type True_Dual_Port_RAM \
  CONFIG.Port_B_Clock 100 \
  CONFIG.Port_B_Enable_Rate 100 \
  CONFIG.Port_B_Write_Rate 50 \
  CONFIG.Use_RSTB_Pin true \
  CONFIG.use_bram_block BRAM_Controller \
] [get_bd_cells lmb_bram]
create_bd_cell -type ip -vlnv xilinx.com:ip:lmb_bram_if_cntlr:4.0 lmb_bram_if_cntlr
set_property -dict {CONFIG.C_ECC 0 CONFIG.C_NUM_LMB 2} [get_bd_cells lmb_bram_if_cntlr]

# ---- hierarchy /iop_pmod1 ----
current_bd_instance /iop_pmod1
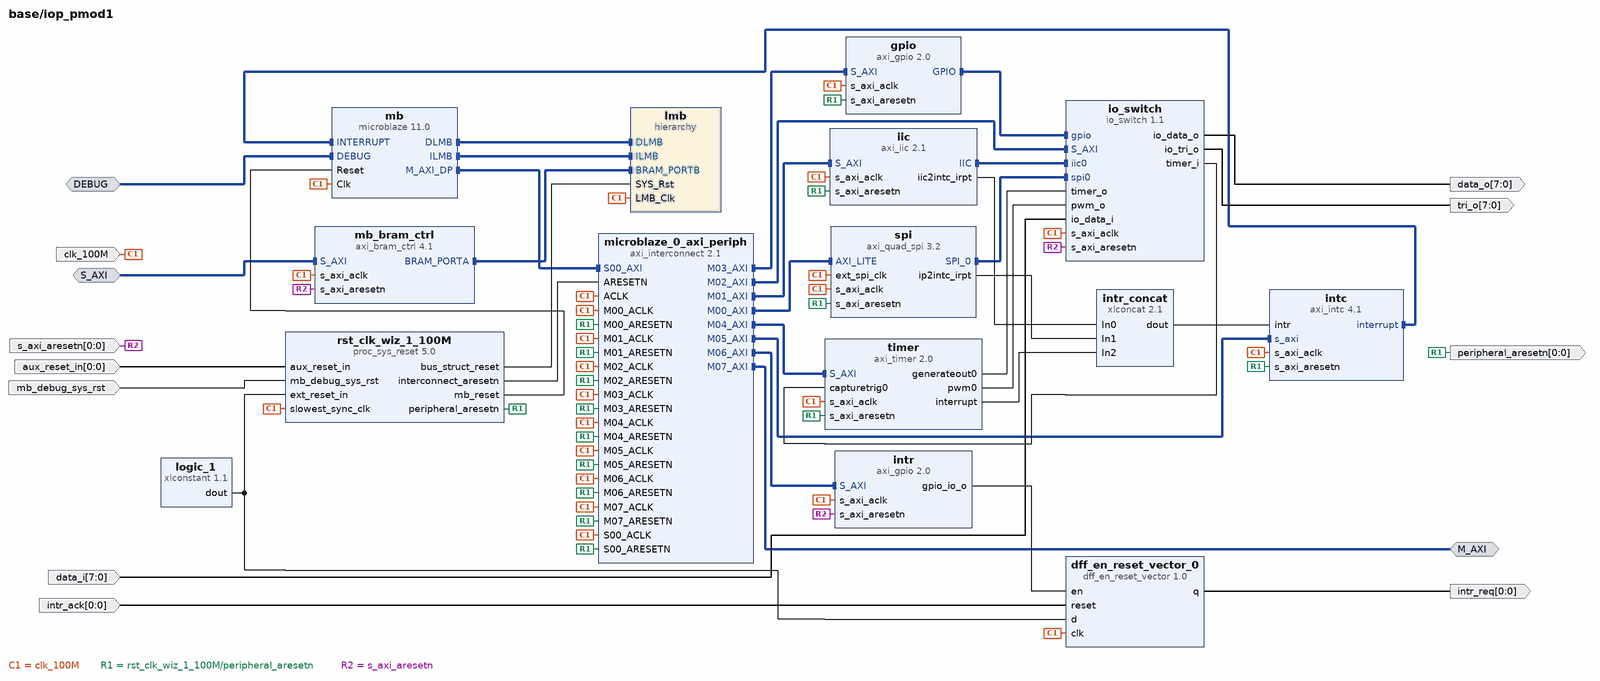
[diagram p4: block diagram inside /iop_pmod1]
create_bd_intf_pin -mode Slave -vlnv xilinx.com:interface:mbdebug_rtl:3.0 DEBUG
create_bd_intf_pin -mode Master -vlnv xilinx.com:interface:aximm_rtl:1.0 M_AXI
create_bd_intf_pin -mode Slave -vlnv xilinx.com:interface:aximm_rtl:1.0 S_AXI
create_bd_pin -dir I -from 0 -to 0 -type rst aux_reset_in
create_bd_pin -dir I -type clk clk_100M
create_bd_pin -dir I -from 7 -to 0 data_i
create_bd_pin -dir O -from 7 -to 0 data_o
create_bd_pin -dir I -from 0 -to 0 intr_ack
create_bd_pin -dir O -from 0 -to 0 intr_req
create_bd_pin -dir I -type rst mb_debug_sys_rst
create_bd_pin -dir O -from 0 -to 0 -type rst peripheral_aresetn
create_bd_pin -dir I -from 0 -to 0 -type rst s_axi_aresetn
create_bd_pin -dir O -from 7 -to 0 tri_o

create_bd_cell -type ip -vlnv xilinx.com:user:dff_en_reset_vector:1.0 dff_en_reset_vector_0
set_property -dict {CONFIG.SIZE 1} [get_bd_cells dff_en_reset_vector_0]
create_bd_cell -type ip -vlnv xilinx.com:ip:axi_gpio:2.0 gpio
set_property -dict {CONFIG.C_GPIO_WIDTH 8 CONFIG.C_IS_DUAL 0} [get_bd_cells gpio]
create_bd_cell -type ip -vlnv xilinx.com:ip:axi_iic:2.1 iic
create_bd_cell -type ip -vlnv xilinx.com:ip:axi_intc:4.1 intc
create_bd_cell -type ip -vlnv xilinx.com:ip:axi_gpio:2.0 intr
set_property -dict {CONFIG.C_ALL_OUTPUTS 1 CONFIG.C_GPIO_WIDTH 1} [get_bd_cells intr]
create_bd_cell -type ip -vlnv xilinx.com:ip:xlconcat:2.1 intr_concat
set_property -dict {CONFIG.NUM_PORTS 3} [get_bd_cells intr_concat]
create_bd_cell -type ip -vlnv xilinx.com:user:io_switch:1.1 io_switch
set_property -dict [list \
  CONFIG.C_INTERFACE_TYPE 1 \
  CONFIG.C_IO_SWITCH_WIDTH 8 \
  CONFIG.C_NUM_PWMS 1 \
  CONFIG.C_NUM_TIMERS 1 \
  CONFIG.I2C0_Enable true \
  CONFIG.PWM_Enable true \
  CONFIG.SPI0_Enable true \
  CONFIG.Timer_Enable true \
] [get_bd_cells io_switch]
create_bd_cell -type hier lmb
create_bd_cell -type ip -vlnv xilinx.com:ip:xlconstant:1.1 logic_1
create_bd_cell -type ip -vlnv xilinx.com:ip:microblaze:11.0 mb
set_property -dict [list \
  CONFIG.C_ADDR_TAG_BITS 17 \
  CONFIG.C_DCACHE_ADDR_TAG 17 \
  CONFIG.C_DEBUG_ENABLED 1 \
  CONFIG.C_D_AXI 1 \
  CONFIG.C_D_LMB 1 \
  CONFIG.C_I_LMB 1 \
] [get_bd_cells mb]
create_bd_cell -type ip -vlnv xilinx.com:ip:axi_bram_ctrl:4.1 mb_bram_ctrl
set_property -dict {CONFIG.SINGLE_PORT_BRAM 1} [get_bd_cells mb_bram_ctrl]
create_bd_cell -type ip -vlnv xilinx.com:ip:axi_interconnect:2.1 microblaze_0_axi_periph
set_property -dict [list \
  CONFIG.M00_HAS_REGSLICE 1 \
  CONFIG.M01_HAS_REGSLICE 1 \
  CONFIG.M02_HAS_REGSLICE 1 \
  CONFIG.M03_HAS_REGSLICE 1 \
  CONFIG.M04_HAS_REGSLICE 1 \
  CONFIG.M05_HAS_REGSLICE 1 \
  CONFIG.M06_HAS_REGSLICE 1 \
  CONFIG.M07_HAS_REGSLICE 1 \
  CONFIG.NUM_MI 8 \
  CONFIG.S00_HAS_REGSLICE 1 \
] [get_bd_cells microblaze_0_axi_periph]
create_bd_cell -type ip -vlnv xilinx.com:ip:proc_sys_reset:5.0 rst_clk_wiz_1_100M
set_property -dict {CONFIG.C_AUX_RESET_HIGH 1} [get_bd_cells rst_clk_wiz_1_100M]
create_bd_cell -type ip -vlnv xilinx.com:ip:axi_quad_spi:3.2 spi
set_property -dict {CONFIG.C_USE_STARTUP 0} [get_bd_cells spi]
create_bd_cell -type ip -vlnv xilinx.com:ip:axi_timer:2.0 timer

# ---- hierarchy /iop_pmod1/lmb ----
current_bd_instance /iop_pmod1/lmb
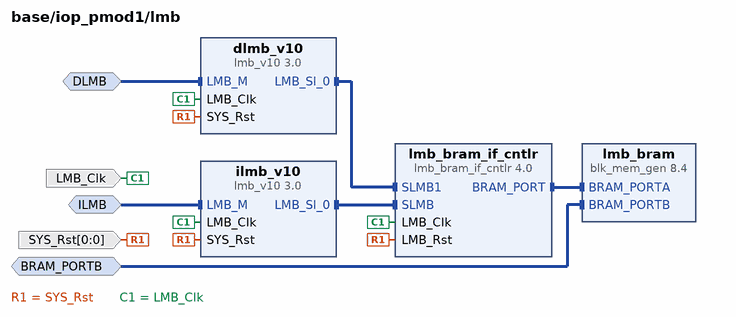
[diagram p5: block diagram inside /iop_pmod1/lmb]
create_bd_intf_pin -mode Slave -vlnv xilinx.com:interface:bram_rtl:1.0 BRAM_PORTB
create_bd_intf_pin -mode MirroredMaster -vlnv xilinx.com:interface:lmb_rtl:1.0 DLMB
create_bd_intf_pin -mode MirroredMaster -vlnv xilinx.com:interface:lmb_rtl:1.0 ILMB
create_bd_pin -dir I -type clk LMB_Clk
create_bd_pin -dir I -from 0 -to 0 -type rst SYS_Rst

create_bd_cell -type ip -vlnv xilinx.com:ip:lmb_v10:3.0 dlmb_v10
create_bd_cell -type ip -vlnv xilinx.com:ip:lmb_v10:3.0 ilmb_v10
create_bd_cell -type ip -vlnv xilinx.com:ip:blk_mem_gen:8.4 lmb_bram
set_property -dict [list \
  CONFIG.Enable_B Use_ENB_Pin \
  CONFIG.Memory_Type True_Dual_Port_RAM \
  CONFIG.Port_B_Clock 100 \
  CONFIG.Port_B_Enable_Rate 100 \
  CONFIG.Port_B_Write_Rate 50 \
  CONFIG.Use_RSTB_Pin true \
  CONFIG.use_bram_block BRAM_Controller \
] [get_bd_cells lmb_bram]
create_bd_cell -type ip -vlnv xilinx.com:ip:lmb_bram_if_cntlr:4.0 lmb_bram_if_cntlr
set_property -dict {CONFIG.C_ECC 0 CONFIG.C_NUM_LMB 2} [get_bd_cells lmb_bram_if_cntlr]

# ---- hierarchy /radio ----
current_bd_instance /radio
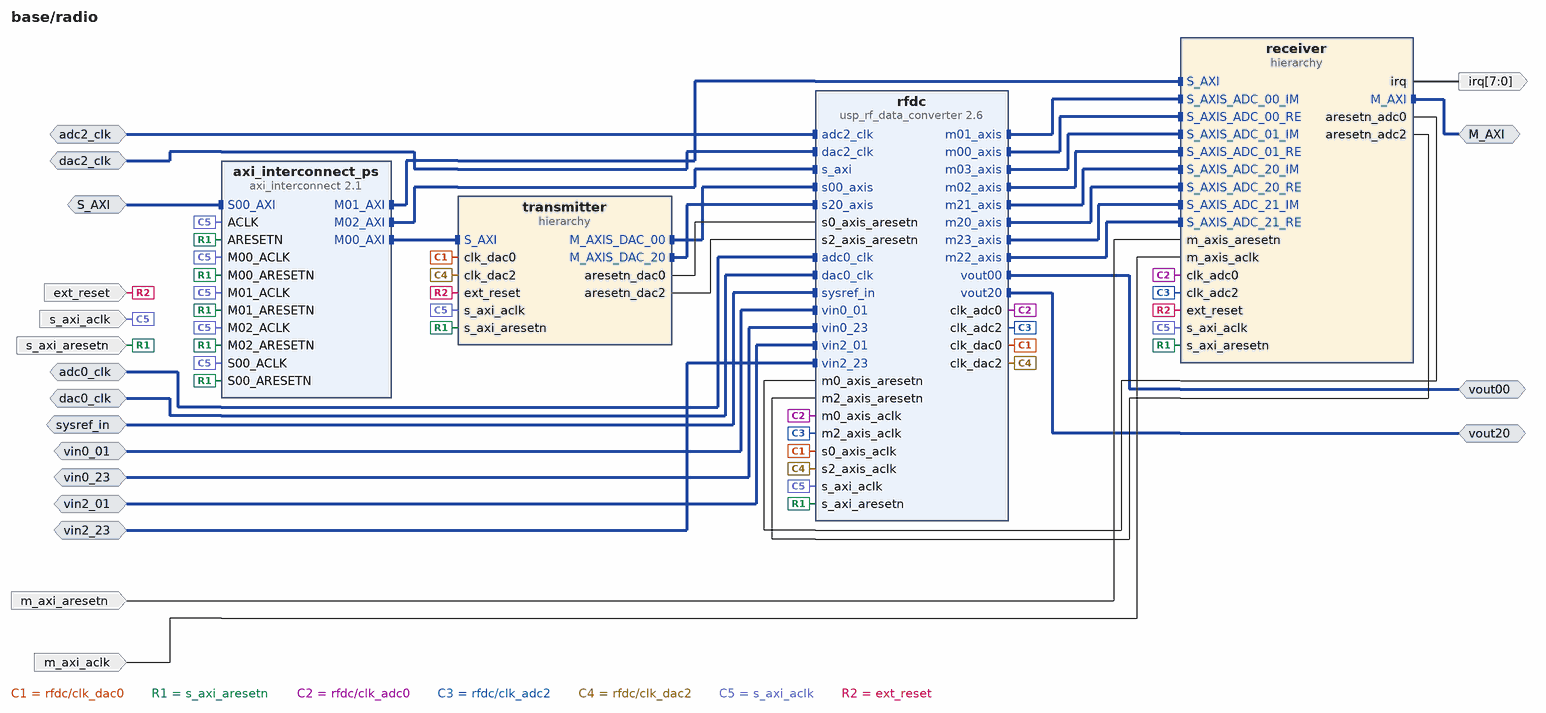
[diagram p6: block diagram inside /radio]
create_bd_intf_pin -mode Master -vlnv xilinx.com:interface:aximm_rtl:1.0 M_AXI
create_bd_intf_pin -mode Slave -vlnv xilinx.com:interface:aximm_rtl:1.0 S_AXI
create_bd_intf_pin -mode Slave -vlnv xilinx.com:interface:diff_clock_rtl:1.0 adc0_clk
create_bd_intf_pin -mode Slave -vlnv xilinx.com:interface:diff_clock_rtl:1.0 adc2_clk
create_bd_intf_pin -mode Slave -vlnv xilinx.com:interface:diff_clock_rtl:1.0 dac0_clk
create_bd_intf_pin -mode Slave -vlnv xilinx.com:interface:diff_clock_rtl:1.0 dac2_clk
create_bd_intf_pin -mode Slave -vlnv xilinx.com:display_usp_rf_data_converter:diff_pins_rtl:1.0 sysref_in
create_bd_intf_pin -mode Slave -vlnv xilinx.com:interface:diff_analog_io_rtl:1.0 vin0_01
create_bd_intf_pin -mode Slave -vlnv xilinx.com:interface:diff_analog_io_rtl:1.0 vin0_23
create_bd_intf_pin -mode Slave -vlnv xilinx.com:interface:diff_analog_io_rtl:1.0 vin2_01
create_bd_intf_pin -mode Slave -vlnv xilinx.com:interface:diff_analog_io_rtl:1.0 vin2_23
create_bd_intf_pin -mode Master -vlnv xilinx.com:interface:diff_analog_io_rtl:1.0 vout00
create_bd_intf_pin -mode Master -vlnv xilinx.com:interface:diff_analog_io_rtl:1.0 vout20
create_bd_pin -dir I -type rst ext_reset
create_bd_pin -dir O -from 7 -to 0 irq
create_bd_pin -dir I -type clk m_axi_aclk
create_bd_pin -dir I -type rst m_axi_aresetn
create_bd_pin -dir I -type clk s_axi_aclk
create_bd_pin -dir I -type rst s_axi_aresetn

create_bd_cell -type ip -vlnv xilinx.com:ip:axi_interconnect:2.1 axi_interconnect_ps
set_property -dict {CONFIG.NUM_MI 3} [get_bd_cells axi_interconnect_ps]
create_bd_cell -type hier receiver
create_bd_cell -type ip -vlnv xilinx.com:ip:usp_rf_data_converter:2.6 rfdc
set_property -dict [list \
  CONFIG.ADC0_Outclk_Freq 307.200 \
  CONFIG.ADC0_PLL_Enable true \
  CONFIG.ADC0_Refclk_Freq 491.520 \
  CONFIG.ADC0_Sampling_Rate 4.9152 \
  CONFIG.ADC2_Outclk_Freq 307.200 \
  CONFIG.ADC2_PLL_Enable true \
  CONFIG.ADC2_Refclk_Freq 491.520 \
  CONFIG.ADC2_Sampling_Rate 4.9152 \
  CONFIG.ADC_Data_Type00 1 \
  CONFIG.ADC_Data_Type02 1 \
  CONFIG.ADC_Data_Type20 1 \
  CONFIG.ADC_Data_Type22 1 \
  CONFIG.ADC_Data_Width00 8 \
  CONFIG.ADC_Data_Width02 8 \
  CONFIG.ADC_Data_Width20 8 \
  CONFIG.ADC_Data_Width22 8 \
  CONFIG.ADC_Decimation_Mode00 2 \
  CONFIG.ADC_Decimation_Mode02 2 \
  CONFIG.ADC_Decimation_Mode20 2 \
  CONFIG.ADC_Decimation_Mode22 2 \
  CONFIG.ADC_Mixer_Mode00 0 \
  CONFIG.ADC_Mixer_Mode02 0 \
  CONFIG.ADC_Mixer_Mode20 0 \
  CONFIG.ADC_Mixer_Mode22 0 \
  CONFIG.ADC_Mixer_Type00 2 \
  CONFIG.ADC_Mixer_Type02 2 \
  CONFIG.ADC_Mixer_Type20 2 \
  CONFIG.ADC_Mixer_Type22 2 \
  CONFIG.ADC_OBS02 false \
  CONFIG.ADC_OBS22 false \
  CONFIG.ADC_Slice02_Enable true \
  CONFIG.ADC_Slice20_Enable true \
  CONFIG.ADC_Slice22_Enable true \
  CONFIG.DAC0_Outclk_Freq 307.200 \
  CONFIG.DAC0_PLL_Enable true \
  CONFIG.DAC0_Refclk_Freq 491.520 \
  CONFIG.DAC0_Sampling_Rate 4.9152 \
  CONFIG.DAC2_Outclk_Freq 307.200 \
  CONFIG.DAC2_PLL_Enable true \
  CONFIG.DAC2_Refclk_Freq 491.520 \
  CONFIG.DAC2_Sampling_Rate 4.9152 \
  CONFIG.DAC_Interpolation_Mode00 2 \
  CONFIG.DAC_Interpolation_Mode20 2 \
  CONFIG.DAC_Mixer_Mode00 0 \
  CONFIG.DAC_Mixer_Mode20 0 \
  CONFIG.DAC_Mixer_Type00 2 \
  CONFIG.DAC_Mixer_Type20 2 \
  CONFIG.DAC_Slice00_Enable true \
  CONFIG.DAC_Slice02_Enable false \
  CONFIG.DAC_Slice20_Enable true \
] [get_bd_cells rfdc]
create_bd_cell -type hier transmitter

# ---- hierarchy /radio/receiver ----
current_bd_instance /radio/receiver
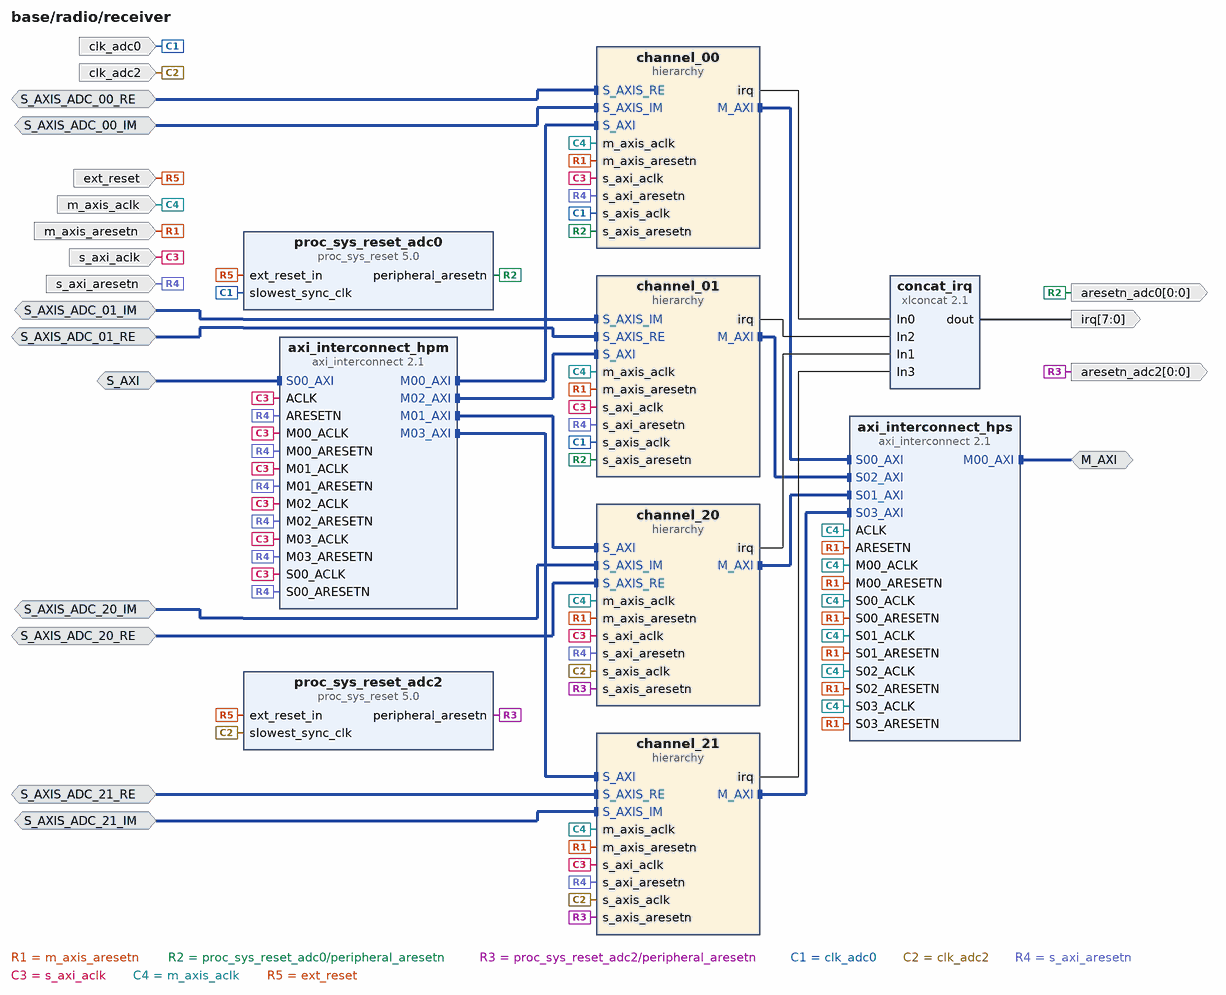
[diagram p7: block diagram inside /radio/receiver]
create_bd_intf_pin -mode Master -vlnv xilinx.com:interface:aximm_rtl:1.0 M_AXI
create_bd_intf_pin -mode Slave -vlnv xilinx.com:interface:aximm_rtl:1.0 S_AXI
create_bd_intf_pin -mode Slave -vlnv xilinx.com:interface:axis_rtl:1.0 S_AXIS_ADC_00_IM
create_bd_intf_pin -mode Slave -vlnv xilinx.com:interface:axis_rtl:1.0 S_AXIS_ADC_00_RE
create_bd_intf_pin -mode Slave -vlnv xilinx.com:interface:axis_rtl:1.0 S_AXIS_ADC_01_IM
create_bd_intf_pin -mode Slave -vlnv xilinx.com:interface:axis_rtl:1.0 S_AXIS_ADC_01_RE
create_bd_intf_pin -mode Slave -vlnv xilinx.com:interface:axis_rtl:1.0 S_AXIS_ADC_20_IM
create_bd_intf_pin -mode Slave -vlnv xilinx.com:interface:axis_rtl:1.0 S_AXIS_ADC_20_RE
create_bd_intf_pin -mode Slave -vlnv xilinx.com:interface:axis_rtl:1.0 S_AXIS_ADC_21_IM
create_bd_intf_pin -mode Slave -vlnv xilinx.com:interface:axis_rtl:1.0 S_AXIS_ADC_21_RE
create_bd_pin -dir O -from 0 -to 0 -type rst aresetn_adc0
create_bd_pin -dir O -from 0 -to 0 -type rst aresetn_adc2
create_bd_pin -dir I -type clk clk_adc0
create_bd_pin -dir I -type clk clk_adc2
create_bd_pin -dir I -type rst ext_reset
create_bd_pin -dir O -from 7 -to 0 irq
create_bd_pin -dir I -type clk m_axis_aclk
create_bd_pin -dir I -type rst m_axis_aresetn
create_bd_pin -dir I -type clk s_axi_aclk
create_bd_pin -dir I -type rst s_axi_aresetn

create_bd_cell -type ip -vlnv xilinx.com:ip:axi_interconnect:2.1 axi_interconnect_hpm
set_property -dict {CONFIG.NUM_MI 4} [get_bd_cells axi_interconnect_hpm]
create_bd_cell -type ip -vlnv xilinx.com:ip:axi_interconnect:2.1 axi_interconnect_hps
set_property -dict [list \
  CONFIG.NUM_MI 1 \
  CONFIG.NUM_SI 4 \
  CONFIG.S00_HAS_DATA_FIFO 0 \
  CONFIG.S01_HAS_DATA_FIFO 0 \
  CONFIG.STRATEGY 0 \
] [get_bd_cells axi_interconnect_hps]
create_bd_cell -type hier channel_00
create_bd_cell -type hier channel_01
create_bd_cell -type hier channel_20
create_bd_cell -type hier channel_21
create_bd_cell -type ip -vlnv xilinx.com:ip:xlconcat:2.1 concat_irq
set_property -dict {CONFIG.NUM_PORTS 4} [get_bd_cells concat_irq]
create_bd_cell -type ip -vlnv xilinx.com:ip:proc_sys_reset:5.0 proc_sys_reset_adc0
create_bd_cell -type ip -vlnv xilinx.com:ip:proc_sys_reset:5.0 proc_sys_reset_adc2

# ---- hierarchy /radio/receiver/channel_00 ----
current_bd_instance /radio/receiver/channel_00
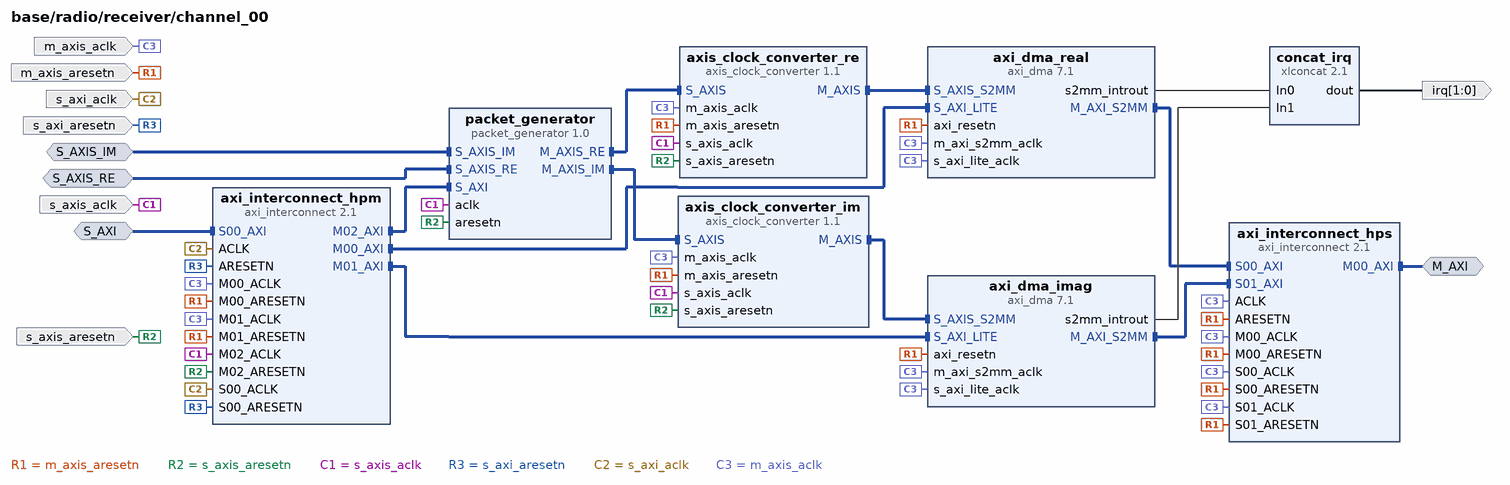
[diagram p8: block diagram inside /radio/receiver/channel_00]
create_bd_intf_pin -mode Master -vlnv xilinx.com:interface:aximm_rtl:1.0 M_AXI
create_bd_intf_pin -mode Slave -vlnv xilinx.com:interface:aximm_rtl:1.0 S_AXI
create_bd_intf_pin -mode Slave -vlnv xilinx.com:interface:axis_rtl:1.0 S_AXIS_IM
create_bd_intf_pin -mode Slave -vlnv xilinx.com:interface:axis_rtl:1.0 S_AXIS_RE
create_bd_pin -dir O -from 1 -to 0 irq
create_bd_pin -dir I -type clk m_axis_aclk
create_bd_pin -dir I -type rst m_axis_aresetn
create_bd_pin -dir I -type clk s_axi_aclk
create_bd_pin -dir I -type rst s_axi_aresetn
create_bd_pin -dir I -type clk s_axis_aclk
create_bd_pin -dir I -type rst s_axis_aresetn

create_bd_cell -type ip -vlnv xilinx.com:ip:axi_dma:7.1 axi_dma_imag
set_property -dict [list \
  CONFIG.c_addr_width 64 \
  CONFIG.c_include_mm2s 0 \
  CONFIG.c_include_sg 0 \
  CONFIG.c_s2mm_burst_size 256 \
  CONFIG.c_sg_length_width 26 \
] [get_bd_cells axi_dma_imag]
create_bd_cell -type ip -vlnv xilinx.com:ip:axi_dma:7.1 axi_dma_real
set_property -dict [list \
  CONFIG.c_addr_width 64 \
  CONFIG.c_include_mm2s 0 \
  CONFIG.c_include_sg 0 \
  CONFIG.c_s2mm_burst_size 256 \
  CONFIG.c_sg_length_width 26 \
] [get_bd_cells axi_dma_real]
create_bd_cell -type ip -vlnv xilinx.com:ip:axi_interconnect:2.1 axi_interconnect_hpm
set_property -dict {CONFIG.NUM_MI 3} [get_bd_cells axi_interconnect_hpm]
create_bd_cell -type ip -vlnv xilinx.com:ip:axi_interconnect:2.1 axi_interconnect_hps
set_property -dict [list \
  CONFIG.M00_HAS_DATA_FIFO 0 \
  CONFIG.NUM_MI 1 \
  CONFIG.NUM_SI 2 \
  CONFIG.S00_HAS_DATA_FIFO 2 \
  CONFIG.S01_HAS_DATA_FIFO 2 \
  CONFIG.STRATEGY 0 \
] [get_bd_cells axi_interconnect_hps]
create_bd_cell -type ip -vlnv xilinx.com:ip:axis_clock_converter:1.1 axis_clock_converter_im
set_property -dict {CONFIG.SYNCHRONIZATION_STAGES 5} [get_bd_cells axis_clock_converter_im]
create_bd_cell -type ip -vlnv xilinx.com:ip:axis_clock_converter:1.1 axis_clock_converter_re
set_property -dict {CONFIG.SYNCHRONIZATION_STAGES 5} [get_bd_cells axis_clock_converter_re]
create_bd_cell -type ip -vlnv xilinx.com:ip:xlconcat:2.1 concat_irq
create_bd_cell -type ip -vlnv xilinx.com:ip:packet_generator:1.0 packet_generator
set_property -dict {CONFIG.C_S_AXIS_DATA_WIDTH 128} [get_bd_cells packet_generator]

# ---- hierarchy /radio/receiver/channel_01 ----
current_bd_instance /radio/receiver/channel_01
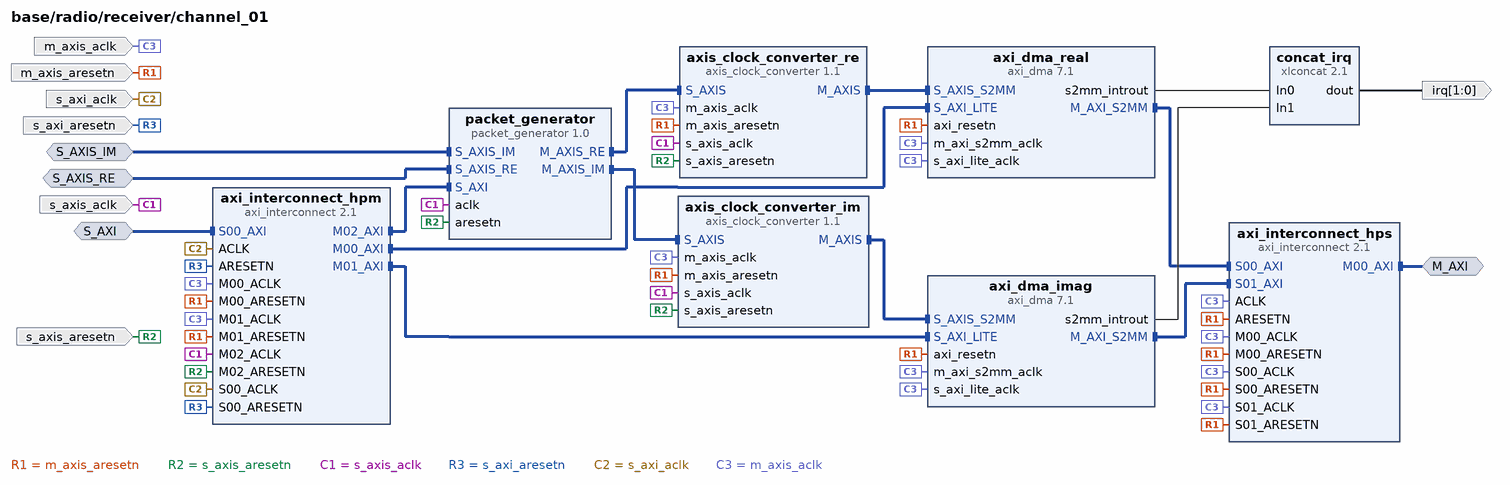
[diagram p9: block diagram inside /radio/receiver/channel_01]
create_bd_intf_pin -mode Master -vlnv xilinx.com:interface:aximm_rtl:1.0 M_AXI
create_bd_intf_pin -mode Slave -vlnv xilinx.com:interface:aximm_rtl:1.0 S_AXI
create_bd_intf_pin -mode Slave -vlnv xilinx.com:interface:axis_rtl:1.0 S_AXIS_IM
create_bd_intf_pin -mode Slave -vlnv xilinx.com:interface:axis_rtl:1.0 S_AXIS_RE
create_bd_pin -dir O -from 1 -to 0 irq
create_bd_pin -dir I -type clk m_axis_aclk
create_bd_pin -dir I -type rst m_axis_aresetn
create_bd_pin -dir I -type clk s_axi_aclk
create_bd_pin -dir I -type rst s_axi_aresetn
create_bd_pin -dir I -type clk s_axis_aclk
create_bd_pin -dir I -type rst s_axis_aresetn

create_bd_cell -type ip -vlnv xilinx.com:ip:axi_dma:7.1 axi_dma_imag
set_property -dict [list \
  CONFIG.c_addr_width 64 \
  CONFIG.c_include_mm2s 0 \
  CONFIG.c_include_sg 0 \
  CONFIG.c_s2mm_burst_size 256 \
  CONFIG.c_sg_length_width 26 \
] [get_bd_cells axi_dma_imag]
create_bd_cell -type ip -vlnv xilinx.com:ip:axi_dma:7.1 axi_dma_real
set_property -dict [list \
  CONFIG.c_addr_width 64 \
  CONFIG.c_include_mm2s 0 \
  CONFIG.c_include_sg 0 \
  CONFIG.c_s2mm_burst_size 256 \
  CONFIG.c_sg_length_width 26 \
] [get_bd_cells axi_dma_real]
create_bd_cell -type ip -vlnv xilinx.com:ip:axi_interconnect:2.1 axi_interconnect_hpm
set_property -dict {CONFIG.NUM_MI 3} [get_bd_cells axi_interconnect_hpm]
create_bd_cell -type ip -vlnv xilinx.com:ip:axi_interconnect:2.1 axi_interconnect_hps
set_property -dict [list \
  CONFIG.M00_HAS_DATA_FIFO 0 \
  CONFIG.NUM_MI 1 \
  CONFIG.NUM_SI 2 \
  CONFIG.S00_HAS_DATA_FIFO 2 \
  CONFIG.S01_HAS_DATA_FIFO 2 \
  CONFIG.STRATEGY 0 \
] [get_bd_cells axi_interconnect_hps]
create_bd_cell -type ip -vlnv xilinx.com:ip:axis_clock_converter:1.1 axis_clock_converter_im
set_property -dict {CONFIG.SYNCHRONIZATION_STAGES 5} [get_bd_cells axis_clock_converter_im]
create_bd_cell -type ip -vlnv xilinx.com:ip:axis_clock_converter:1.1 axis_clock_converter_re
set_property -dict {CONFIG.SYNCHRONIZATION_STAGES 5} [get_bd_cells axis_clock_converter_re]
create_bd_cell -type ip -vlnv xilinx.com:ip:xlconcat:2.1 concat_irq
create_bd_cell -type ip -vlnv xilinx.com:ip:packet_generator:1.0 packet_generator
set_property -dict {CONFIG.C_S_AXIS_DATA_WIDTH 128} [get_bd_cells packet_generator]

# ---- hierarchy /radio/receiver/channel_20 ----
current_bd_instance /radio/receiver/channel_20
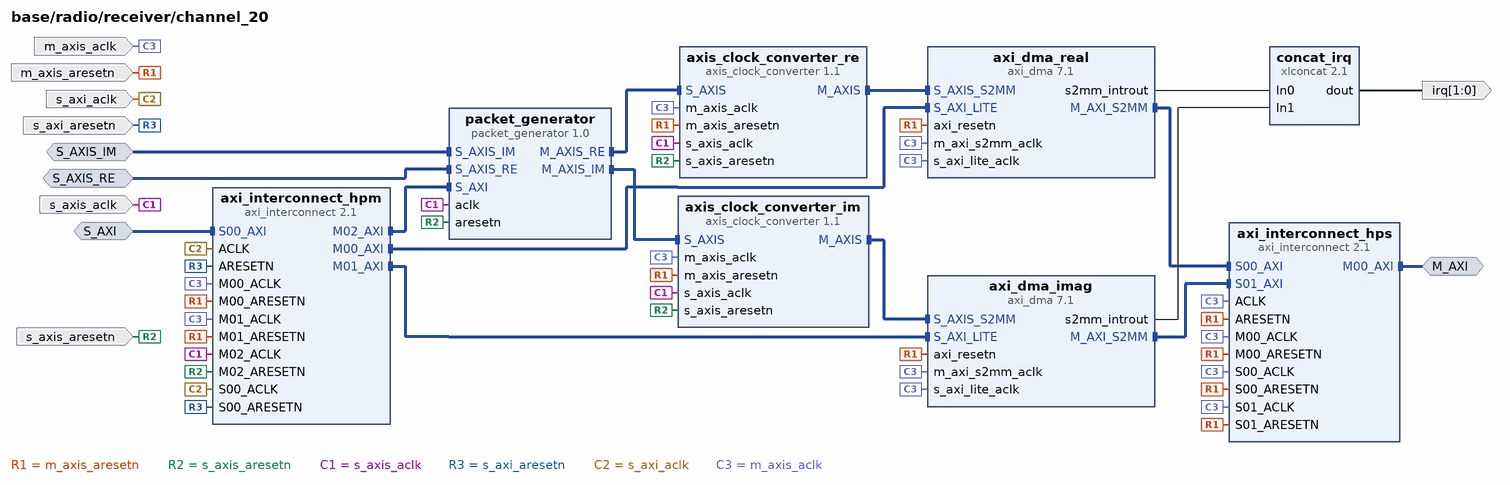
[diagram p10: block diagram inside /radio/receiver/channel_20]
create_bd_intf_pin -mode Master -vlnv xilinx.com:interface:aximm_rtl:1.0 M_AXI
create_bd_intf_pin -mode Slave -vlnv xilinx.com:interface:aximm_rtl:1.0 S_AXI
create_bd_intf_pin -mode Slave -vlnv xilinx.com:interface:axis_rtl:1.0 S_AXIS_IM
create_bd_intf_pin -mode Slave -vlnv xilinx.com:interface:axis_rtl:1.0 S_AXIS_RE
create_bd_pin -dir O -from 1 -to 0 irq
create_bd_pin -dir I -type clk m_axis_aclk
create_bd_pin -dir I -type rst m_axis_aresetn
create_bd_pin -dir I -type clk s_axi_aclk
create_bd_pin -dir I -type rst s_axi_aresetn
create_bd_pin -dir I -type clk s_axis_aclk
create_bd_pin -dir I -type rst s_axis_aresetn
